# EasyEDA Pro project 1.69_chip_version.eprj

# Schematic Schematic1

## Sheets
1 esp32: Board Name: Board1; Create Date: 2025-05-20; Page Name: esp32; Project Name: 1.69_chip_version; Schematic Name: Schematic1; Update Date: 2025-05-29; Company: EasyEDA.com; Page Size: A4; Version: V1.0
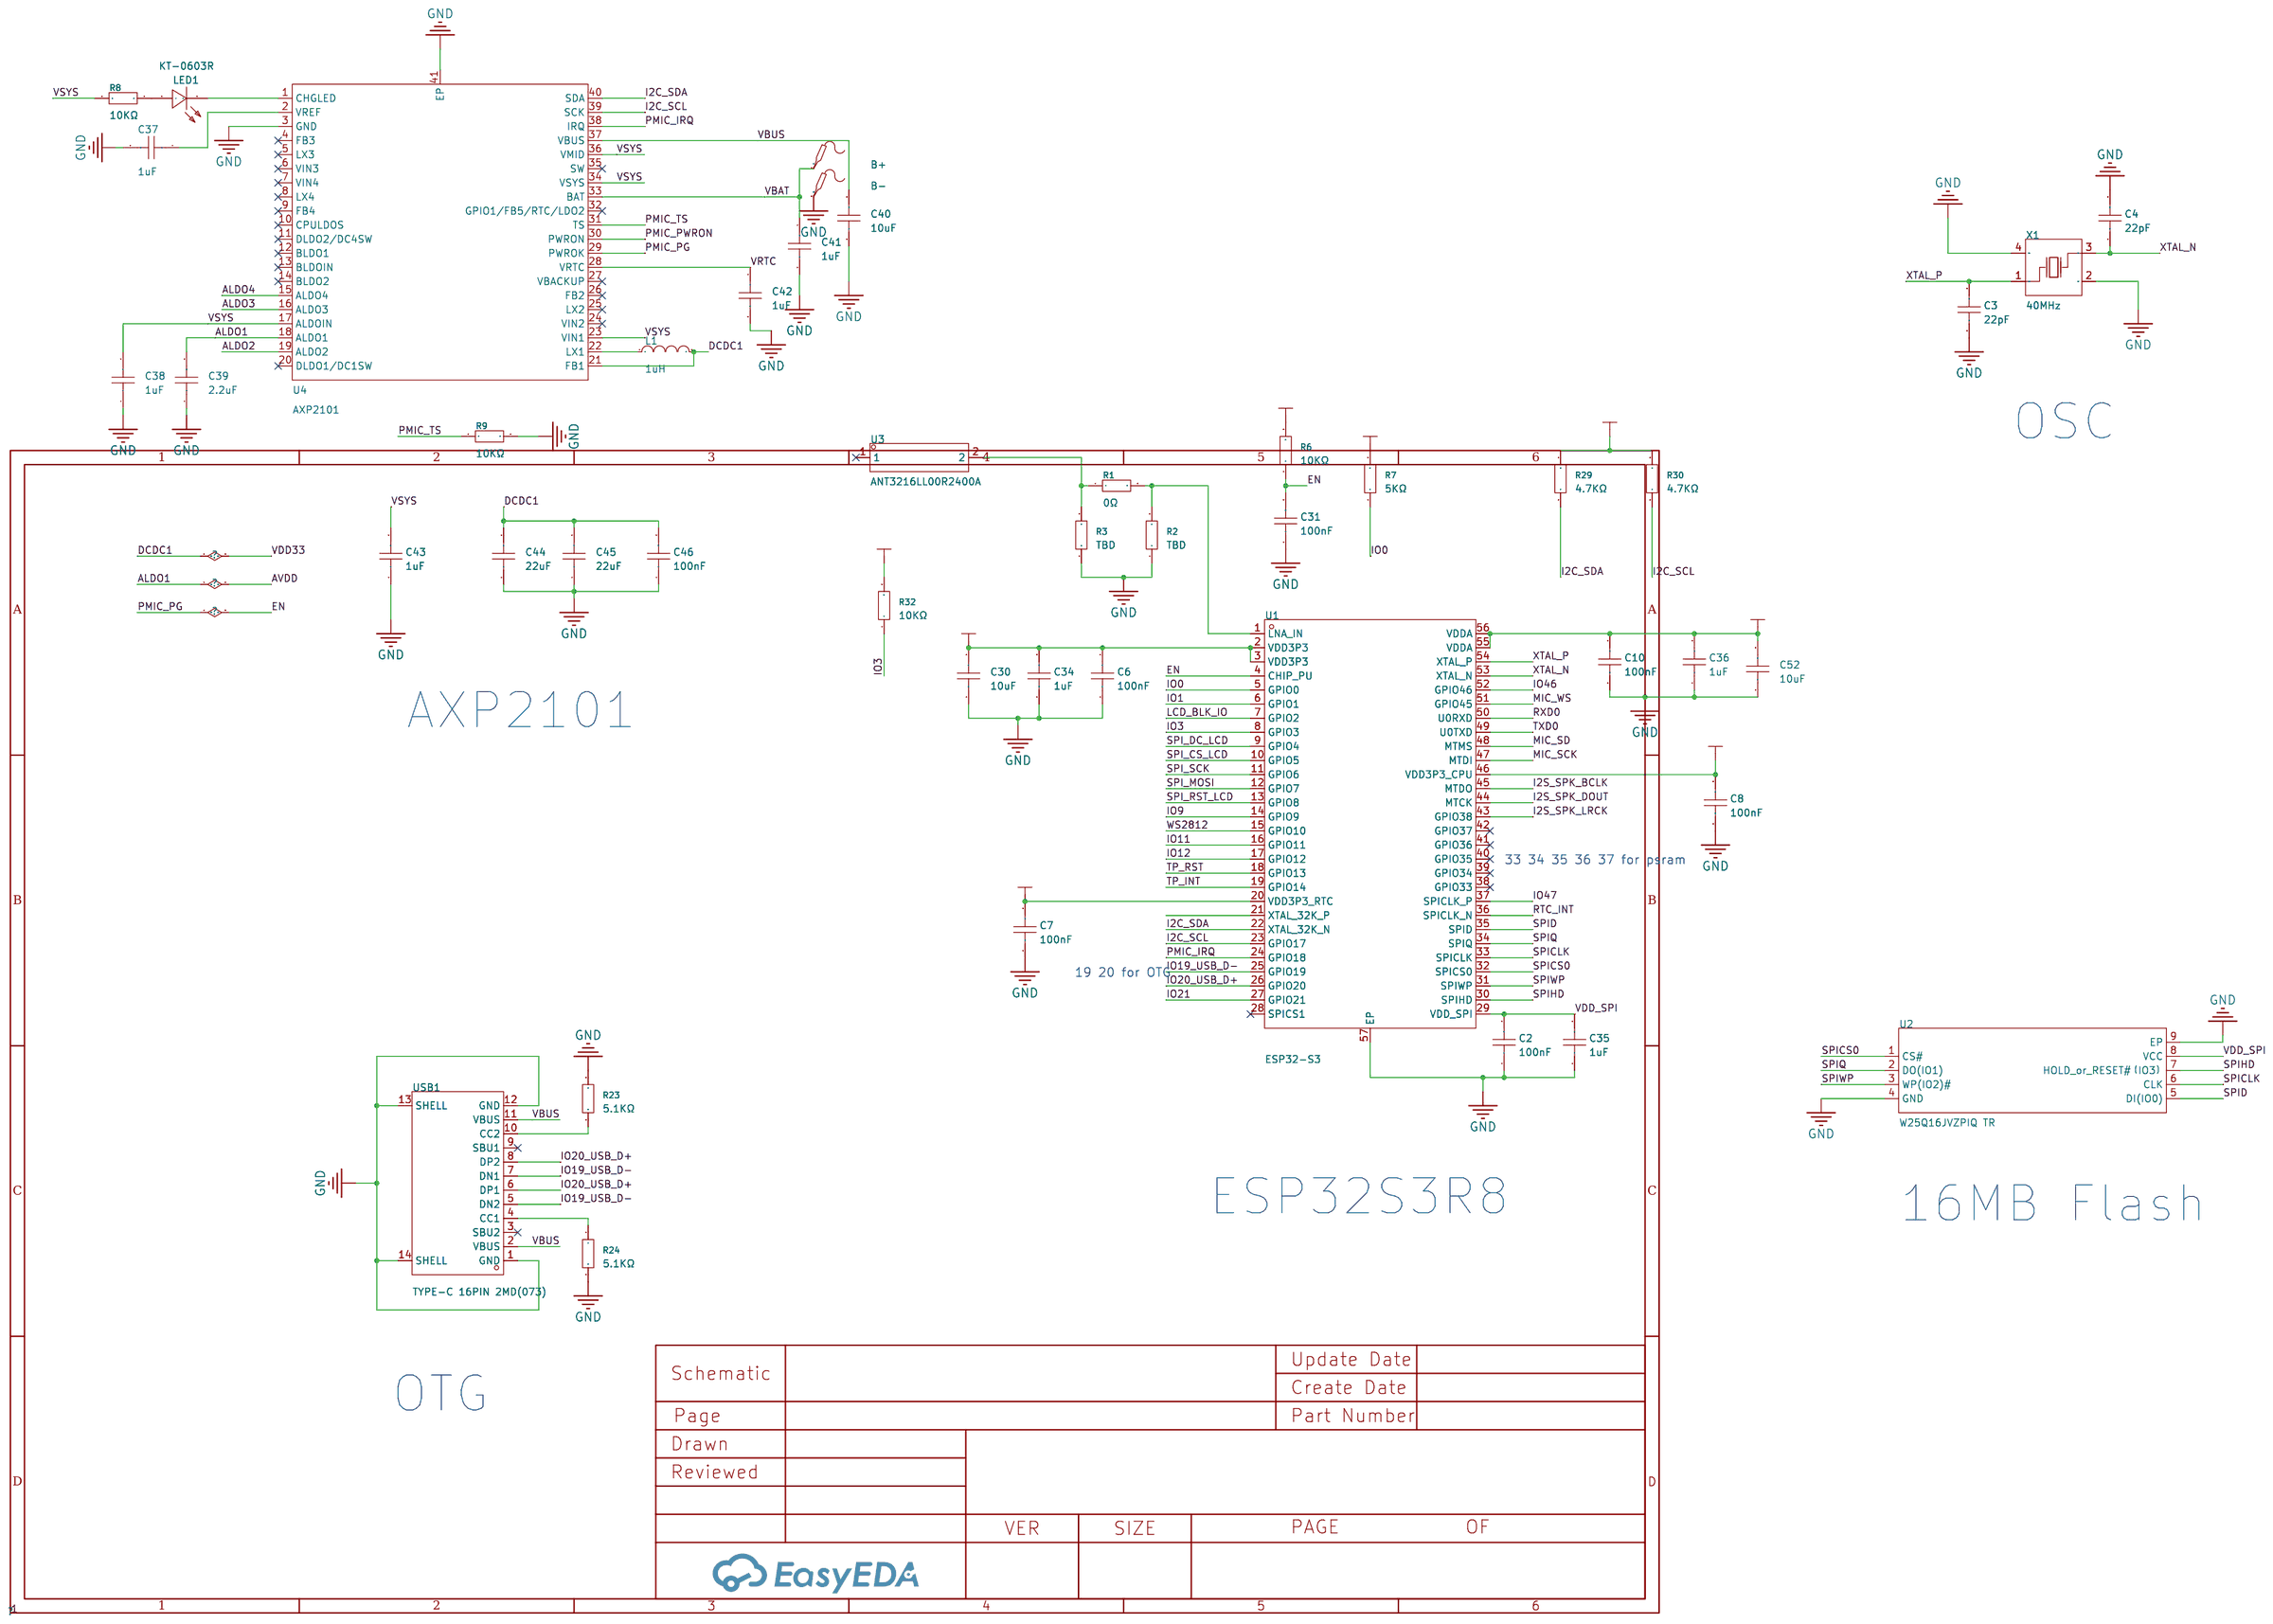
[diagram p0: esp32]
2 peripheral: Page Name: peripheral; Update Date: 2025-05-27
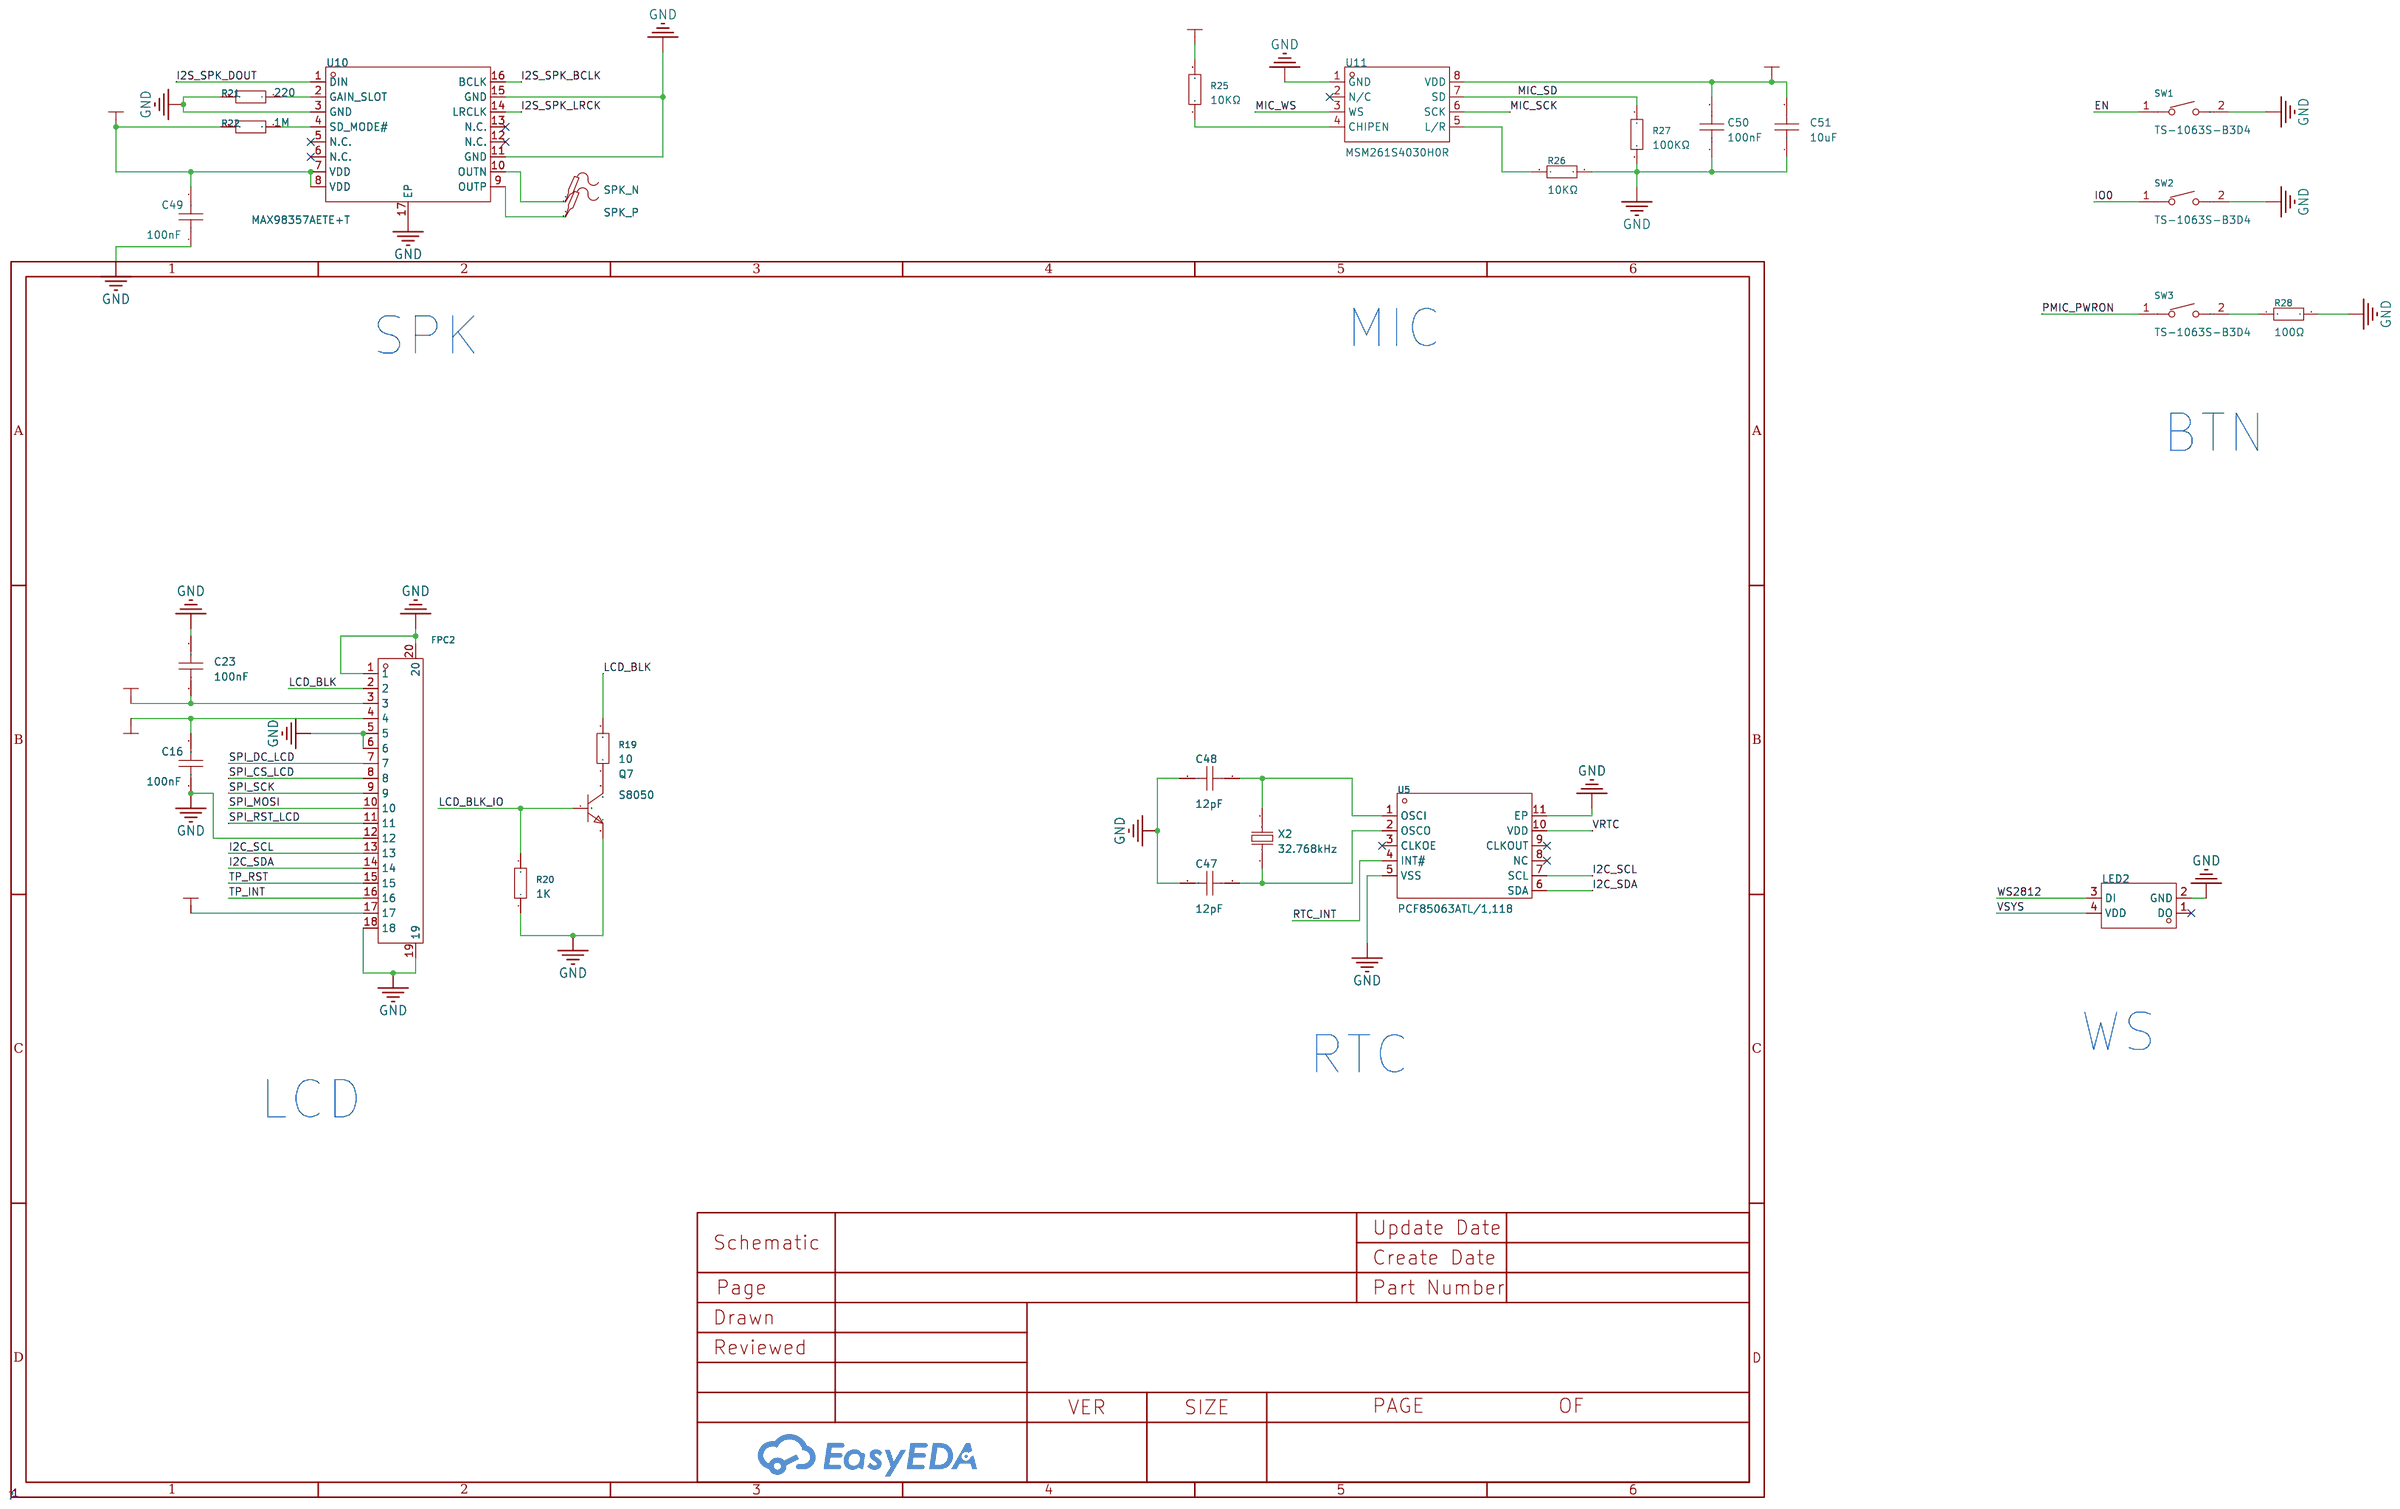
[diagram p1: peripheral]

## Parts
sheet esp32
B+  -  [Test-Point-0.5mm]
B-  -  [Test-Point-0.5mm]
C2  100nF  [C0402]
C3  22pF  [C0402]
C4  22pF  [C0402]
C6  100nF  [C0402]
C7  100nF  [C0402]
C8  100nF  [C0402]
C10  100nF  [C0402]
C30  10uF  [C0603]
C31  100nF  [C0402]
C34  1uF  [C0402]
C35  1uF  [C0402]
C36  1uF  [C0402]
C37  1uF  [C0402]
C38  1uF  [C0402]
C39  2.2uF  [C0603]
C40  10uF  [C0603]
C41  1uF  [C0402]
C42  1uF  [C0402]
C43  1uF  [C0402]
C44  22uF  [C0603]
C45  22uF  [C0603]
C46  100nF  [C0402]
C52  10uF  [C0603]
L1  1uH  [IND-SMD_L4.4-W4.2]
LED1  KT-0603R  [LED0603-RD]
R1  0Ω  [R0402]
R2  TBD  [R0402]
R3  TBD  [R0402]
R6  10KΩ  [R0402]
R7  5KΩ  [R0402]
R8  10KΩ  [R0402]
R9  10KΩ  [R0402]
R23  5.1KΩ  [R0402]
R24  5.1KΩ  [R0402]
R29  4.7KΩ  [R0402]
R30  4.7KΩ  [R0402]
R32  10KΩ  [R0402]
U1  ESP32-S3  [QFN-56_L7.0-W7.0-P0.40-TL-EP4.0]
U2  W25Q16JVZPIQ TR  [WSON-8_L6.0-W5.0-P1.27-BL-EP]
U3  ANT3216LL00R2400A  [ANT-SMD_L3.2-W1.6]
U4  AXP2101  [QFN-40_L5.0-W5.0-P0.40-TL-EP3.4]
USB1  TYPE-C 16PIN 2MD(073)  [USB-C-SMD_TYPE-C-6PIN-2MD-073]
X1  40MHz  [OSC-SMD_4P-L3.2-W2.5-BL_SIT8008BI]
sheet peripheral
C16  100nF  [C0402]
C23  100nF  [C0402]
C47  12pF  [C0402]
C48  12pF  [C0402]
C49  100nF  [C0402]
C50  100nF  [C0402]
C51  10uF  [C0603]
FPC2  FPC-05F-18PH20  [FPC-SMD_18P-P0.50_FPC-05F-18PH20]
LED2  XL-2020RGBC-WS2812B  [LED-SMD_4P-L2.0-W2.0-BR-1]
Q7  S8050  [SOT-23-3_L2.9-W1.3-P1.90-LS2.3-BR]
R19  10  [R0402]
R20  1K  [R0402]
R21  220  [R0402]
R22  1M  [R0402]
R25  10KΩ  [R0402]
R26  10KΩ  [R0402]
R27  100KΩ  [R0402]
R28  100Ω  [R0402]
SPK_N  -  [Test-Point-0.5mm]
SPK_P  -  [Test-Point-0.5mm]
SW1  TS-1063S-B3D4  [KEY-SMD_L3.0-W2.5-LS4.0_TS-1603S]
SW2  TS-1063S-B3D4  [KEY-SMD_L3.0-W2.5-LS4.0_TS-1603S]
SW3  TS-1063S-B3D4  [KEY-SMD_L3.0-W2.5-LS4.0_TS-1603S]
U5  PCF85063ATL/1,118  [DFN-10_L2.6-W2.6-P0.50-BL-EP]
U10  MAX98357AETE+T  [TQFN-16_L3.0-W3.0-P0.50-BL-EP1.5]
U11  MSM261S4030H0R  [MIC-SMD_8P-L4.0-W3.0-P1.00-BR]
X2  32.768kHz  [FC-135R_L3.2-W1.5]

## Library data of the parts
B+ B- SPK_N SPK_P = Test-Point
C2-C4 C6-C8 C10 C31 C34-C38 C41-C43 C46-C48 C50 = CL05A105KA5NQNC: Capacitance: Tolerance:±10% Tolerance:±10% Voltage Rated: Temperature Coefficient:; LCSC Part Name: 1uF ±10% 25V; Supplier Part: C52923; Manufacturer: SAMSUNG(三星); Supplier Footprint: 0402; JLCPCB Part Class: Basic Part; Datasheet: https://atta.szlcsc.com/upload/public/pdf/source/20160218/1457707763339.pdf; Supplier: LCSC; Tolerance: ±10%
C30 C39 C40 C44 C45 C51 C52 = CGA0603X5R106K100JT: Capacitance:10uF Tolerance:±10% Tolerance:±10% Voltage Rating:10V Temperature Coefficient:X5R; LCSC Part Name: 10uF ±10% 10V; Supplier Part: C6119842; Manufacturer: HRE(芯声); Supplier Footprint: 0603; JLCPCB Part Class: Extended Part; Supplier: LCSC; Tolerance: ±10%; Voltage Rating: 10V; Temperature Coefficient: X5R
L1 = FXL0420-1R0-M: LCSC Part Name: 1uH ±20% 7A; Supplier Part: C167203; Manufacturer: cjiang(长江微电); Supplier Footprint: SMD,4.2x4.4mm; JLCPCB Part Class: Extended Part; Datasheet: https://atta.szlcsc.com/upload/public/pdf/source/20240426/3189EA8206330E2108542F9E34E540E7.pdf; Supplier: LCSC; Tolerance: ±20%; Saturation Current (Isat): 7A; Type: Integrated molded inductor
LED1 = KT-0603R: LCSC Part Name: 0603 红灯 高亮; Supplier Part: C2286; Manufacturer: KENTO; Supplier Footprint: 0603; JLCPCB Part Class: Basic Part; Datasheet: https://atta.szlcsc.com/upload/public/pdf/source/20160616/1466072038404.pdf; Supplier: LCSC; Emitted Color: Red; Operating Temperature: -40℃~+85℃
R1-R3 R6-R9 R23-R30 R32 = 0402WGF0000TCE: Type:Thick Film Resistors Resistance: Tolerance:±1% Tolerance:±1% Power(Watts): Overload Voltage (Max): Temperature Coefficient:±800ppm/℃ Temperature Coefficient:±800ppm/℃ Operating Temperature Range:-55℃~+155℃ Operating Temperature Range:-55℃~+155℃; LCSC Part Name: 0Ω ±1% 62.5mW 厚膜电阻; Supplier Part: C17168; Manufacturer: UNI-ROYAL(厚声); Supplier Footprint: 0402; JLCPCB Part Class: Basic Part; Datasheet: https://atta.szlcsc.com/upload/public/pdf/source/20200306/C422600_1E6D84923E4A46A82E41ADD87F860B5C.pdf; Supplier: LCSC; Type: Thick Film Resistors; Tolerance: ±1%; Temperature Coefficient: ±800ppm/℃; Operating Temperature Range: -55℃~+155℃
U1 = ESP32-S3: Frequency Range:2412MHz~2484MHz Frequency Range:2412MHz~2484MHz Interface:ADC,GPIO,I2C,I2S,PWM,SPI,UART,USB Operating Voltage:3V~3.6V Operating Voltage:3V~3.6V Applications:WiFi；IoT Output Power:21dBm Data Rate:150Mbps Current Of Transmitting:340mA Sensit; LCSC Part Name: 支持2.4GHz WIFI和低功耗蓝牙的MCU SoC; Supplier Part: C2913192; Manufacturer: ESPRESSIF(乐鑫); Supplier Footprint: QFN-56-EP(7x7); JLCPCB Part Class: Extended Part; Datasheet: https://atta.szlcsc.com/upload/public/pdf/source/20241030/3428D9BCA56E860957850BFAF37EAC62.pdf; Supplier: LCSC; Frequency Range: 2412MHz~2484MHz; Interface: ADC,GPIO,I2C,I2S,PWM,SPI,UART,USB; Operating Voltage: 3V~3.6V; Applications: WiFi；IoT; Output Power: 21dBm; Data Rate: 150Mbps; Current Of Transmitting: 340mA; Sensitivity: -98.4dBm; Receive Current: 88mA; Typical Application Frequency: 2.4GHz; Operating Temperature: -40℃~+105℃
U2 = W25Q16JVZPIQ TR: Supplier Part: C2456208; Manufacturer: WINBOND(华邦); Supplier Footprint: WSON-8-EP(5x6); JLCPCB Part Class: Extended Part; Datasheet: https://atta.szlcsc.com/upload/public/pdf/source/20190529/C115407_78E5B4F96E7138D299EC51EC5982A1A5.pdf; Supplier: LCSC
U3 = ANT3216LL00R2400A: Antenna Type:Chip Antenna Central Frequency:2450MHz Bandwidth:160MHz Peak Gain:5.05dBi Peak Gain:5.05dBi Polarization Type:Linear Impedance:50Ω Power capacity:1W VSWR:- Operating Temperature:-40℃~+105℃ Operating Temperature:-40℃~+105℃; LCSC Part Name: 无线组件陶瓷芯片天线; Supplier Part: C293767; Manufacturer: YAGEO(国巨); Supplier Footprint: 1206; JLCPCB Part Class: Extended Part; Datasheet: https://atta.szlcsc.com/upload/public/pdf/source/20181012/C293767_CDE82A2F74DC82A94DB708CB53B68F23.pdf; Supplier: LCSC; Antenna Type: Chip Antenna; Central Frequency: 2450MHz; Bandwidth: 160MHz; Peak Gain: 5.05dBi; Polarization Type: Linear; Impedance: 50Ω; Power capacity: 1W; Operating Temperature: -40℃~+105℃
U4 = AXP2101: Supplier Part: C3036461; Manufacturer: x-powers; Supplier Footprint: QFN-40-EP(5x5); JLCPCB Part Class: Extended Part; Datasheet: https://atta.szlcsc.com/upload/public/pdf/source/20230506/27D868F447993329A9E953603DF31964.pdf; Supplier: LCSC
USB1 = TYPE-C 16PIN 2MD(073): LCSC Part Name: Type-C 母 卧贴; Supplier Part: C2765186; Manufacturer: SHOU HAN(首韩); Supplier Footprint: SMD; JLCPCB Part Class: Extended Part; Datasheet: https://atta.szlcsc.com/upload/public/pdf/source/20211123/39B17C16241EAC15C5E277BDA434118E.pdf; Supplier: LCSC; Connector Type: Type-C; Standard: USB 3.1; Gender: Female; Mounting Style: Horizontal attachment; Number of Contacts: 16P; Number of Ports: 1; Current Rating - Power (Max): 5A; Operating Temperature Range: -25℃~+85℃; Rated Voltage (Max): 5V; Connect-Disconnect Life: 5000 Cuts; Core Colour: Black
X1 = X322540MPB4SI: Crystal Type:Surface Mount Crystal Frequency: Normal temperature Frequency Tolerance:±10ppm Normal temperature Frequency Tolerance:±10ppm External load capacitor: Frequency Stability(Full temperature range):±20ppm Frequency Stability(Full temperature rang; LCSC Part Name: 40MHz ±10ppm 15pF; Supplier Part: C9010; Manufacturer: YXC(扬兴晶振); Supplier Footprint: SMD3225-4P; JLCPCB Part Class: Extended Part; Datasheet: https://atta.szlcsc.com/upload/public/pdf/source/20240329/19D5F850207469550BEB00D7DFEDBC7A.pdf; Supplier: LCSC; Crystal Type: Surface Mount Crystal; Normal temperature Frequency Tolerance: ±10ppm; Frequency Stability(Full temperature range): ±20ppm
C16 C23 C49 = CL05B104KO5NNNC: Capacitance: Tolerance:±10% Tolerance:±10% Voltage Rated: Temperature Coefficient:; LCSC Part Name: 100nF ±10% 16V; Supplier Part: C1525; Manufacturer: SAMSUNG(三星); Supplier Footprint: 0402; JLCPCB Part Class: Basic Part; Datasheet: https://atta.szlcsc.com/upload/public/pdf/source/20160218/1457707763339.pdf; Supplier: LCSC; Tolerance: ±10%
FPC2 = FPC-05F-18PH20: Locking Feature:Clamshell Contact Type:Bottom Contact Number of Contacts:18P Pitch:0.5mm Mounting Type:卧贴 FFC, FCB Thickness:0.3mm FFC, FCB Thickness:0.3mm Height Above Board:2mm Operating Temperature Range:-25℃~+85℃ Operating Temperature Range:-25℃~+85℃; LCSC Part Name: 间距:0.5mm P数:18P 翻盖式 下接; Supplier Part: C2856802; Manufacturer: XUNPU(讯普); Supplier Footprint: SMD,P=0.5mm,卧贴; JLCPCB Part Class: Extended Part; Datasheet: https://atta.szlcsc.com/upload/public/pdf/source/20210922/C2856802_2A845D1961F33AEC1ED22CECB292335F.pdf; Supplier: LCSC; Locking Feature: Clamshell; Contact Type: Bottom Contact; Number of Contacts: 18P; Pitch: 0.5mm; Mounting Type: 卧贴; FFC, FCB Thickness: 0.3mm; Height Above Board: 2mm; Operating Temperature Range: -25℃~+85℃
LED2 = XL-2020RGBC-WS2812B: Wavelength:620nm~625nm；470nm~475nm；525nm~530nm Luminous Intensity:150mcd；150mcd；400mcd Lens Color:Translucent Fog Lens Installation method:Positive Stick Operating Temperature:-20℃~+85℃; LCSC Part Name: 幻彩透明; Supplier Part: C5349955; Manufacturer: XINGLIGHT(成兴光); Supplier Footprint: 2020; JLCPCB Part Class: Extended Part; Datasheet: https://atta.szlcsc.com/upload/public/pdf/source/20230111/97A2D5930F183799801175706AF118AF.pdf; Supplier: LCSC; Wavelength: 620nm~625nm；470nm~475nm；525nm~530nm; Luminous Intensity: 150mcd；150mcd；400mcd; Lens Color: Translucent Fog Lens; Installation method: Positive Stick; Operating Temperature: -20℃~+85℃
Q7 = S8050_C20069125: type:NPN Current - Collector(Ic): Collector - Emitter Voltage VCEO: Pd - Power Dissipation:300mW DC Current Gain:120@50mA,1.0V DC Current Gain:120@50mA,1.0V Transition frequency(fT):100MHz Current - Collector Cutoff:100nA Vce Saturation(VCE(sat)):600mV Op; LCSC Part Name: hFE:200-350，丝印:J3Y S8050; Supplier Part: C20069125; Manufacturer: 宏嘉诚; Supplier Footprint: SOT-23; JLCPCB Part Class: Extended Part; Datasheet: https://atta.szlcsc.com/upload/public/pdf/source/20250107/343E8B94B5C24D0D65D7D4B70E0B73F6.pdf; Supplier: LCSC; type: NPN; Pd - Power Dissipation: 300mW; DC Current Gain: 120@50mA,1.0V; Transition frequency(fT): 100MHz; Current - Collector Cutoff: 100nA; Vce Saturation(VCE(sat)): 600mV; Operating Temperature: -55℃~+150℃
R19-R22 = 0402WGF4700TCE: Type:Thick Film Resistors Resistance: Tolerance:±1% Tolerance:±1% Power(Watts): Overload Voltage (Max): Temperature Coefficient:±100ppm/℃ Temperature Coefficient:±100ppm/℃ Operating Temperature Range:-55℃~+155℃ Operating Temperature Range:-55℃~+155℃; LCSC Part Name: 470Ω ±1% 62.5mW 厚膜电阻; Supplier Part: C25117; Manufacturer: UNI-ROYAL(厚声); Supplier Footprint: 0402; JLCPCB Part Class: Basic Part; Datasheet: https://atta.szlcsc.com/upload/public/pdf/source/20200306/C422600_1E6D84923E4A46A82E41ADD87F860B5C.pdf; Supplier: LCSC; Type: Thick Film Resistors; Tolerance: ±1%; Temperature Coefficient: ±100ppm/℃; Operating Temperature Range: -55℃~+155℃
SW1-SW3 = TS-1063S-B3D4: LCSC Part Name: 轻触开关3.0*2.5侧按贴片带柱小小龟250gf; Supplier Part: C498291; Manufacturer: Yuandi(元迪); JLCPCB Part Class: Extended Part; Datasheet: https://atta.szlcsc.com/upload/public/pdf/source/20200318/C498291_A3607BD92317BA61A63F6AFAF35A0DD0.pdf; Supplier: LCSC; Circuit: SPST; Actuator Style: Rectangle button; Operating Force: 250gf
U5 = PCF85063ATL/1,118: Supplier Part: C404360; Manufacturer: NXP(恩智浦); Supplier Footprint: DFN-10-EP(2.6x2.6); JLCPCB Part Class: Extended Part; Datasheet: https://www.nxp.com.cn/docs/en/data-sheet/PCF85063A.pdf; Supplier: LCSC
U10 = MAX98357AETE+T: Type of Power Amplifier: Speaker Channels:Monaural Output Power: Supply Voltage:2.5V~5.5V Supply Voltage:2.5V~5.5V Operating Temperature:-40℃~+85℃ Operating Temperature:-40℃~+85℃; LCSC Part Name: 微型、低成本、PCM 类 D 级放大器具有 AB 级性能; Supplier Part: C910544; Manufacturer: ADI(亚德诺)/MAXIM(美信); Supplier Footprint: TQFN-16-EP(3x3); JLCPCB Part Class: Extended Part; Datasheet: https://atta.szlcsc.com/upload/public/pdf/source/20210106/C910544_CB6DE4B2CEE254A72E6BDB40E718D281.pdf; Supplier: LCSC; Speaker Channels: Monaural; Supply Voltage: 2.5V~5.5V; Operating Temperature: -40℃~+85℃
U11 = MSM261S4030H0R: Supplier Part: C2840615; Manufacturer: MEMS(敏芯微); JLCPCB Part Class: Extended Part; Datasheet: https://atta.szlcsc.com/upload/public/pdf/source/20210707/C2840615_6AE5BCBEE3224C96A8195D5DC270E7C8.pdf; Supplier: LCSC
X2 = Q13FC13500004_C32346: LCSC Part Name: 32.768kHz ±20ppm 12.5pF; Supplier Part: C32346; Manufacturer: EPSON(爱普生); Manufacturer Part: Q13FC13500004; Supplier Footprint: SMD3215-2P; Datasheet: https://atta.szlcsc.com/upload/public/pdf/source/20240418/0E0FF5F0356BA3753F616001439D1416.pdf; Supplier: LCSC; Crystal Type: Surface Mount Crystal; Normal temperature Frequency Tolerance: ±20ppm; Equivalent Series Resistance (ESR): 70kΩ

## Nets
AVDD: C39.2 C49.2 C50.2 C51.2 R22.2 R25.2 U4.18(ALDO1) U10.7(VDD) U10.8(VDD) U11.8(VDD)
GND: B-.1 C2.1 C3.1 C4.2 C6.1 C7.1 C8.1 C10.1 C16.1 C23.1 C30.1 C31.1 C34.1 C35.1 C36.1 C37.2 C38.1 C39.1 C40.1 C41.2 C42.2 C43.1 C44.1 C45.1 C46.1 C47.2 C48.2 C49.1 C50.1 C51.1 C52.1 FPC2.1 FPC2.5 FPC2.6 FPC2.12 FPC2.18 FPC2.19 FPC2.20 LED2.2(GND) Q7.2(E) R2.1 R3.1 R9.1 R20.1 R21.2 R23.1 R24.2 R26.1 R27.2 R28.2 SW1.2 SW2.2 U1.57(EP) U2.4(GND) U2.9(EP) U4.3(GND) U4.41(EP) U5.5(VSS) U5.11(EP) U10.3(GND) U10.11(GND) U10.15(GND) U10.17(EP) U11.1(GND) USB1.1(GND) USB1.12(GND) USB1.13(SHELL) USB1.14(SHELL) X1.2(GND) X1.4(GND)
VBAT: B+.1 C41.1 U4.33(BAT)
VBUS: C40.2 U4.37(VBUS) USB1.2(VBUS) USB1.11(VBUS)
VDD33: C6.2 C7.2 C8.2 C10.2 C16.2 C23.2 C30.2 C34.2 C36.2 C44.2 C45.2 C46.2 C52.2 FPC2.3 FPC2.4 FPC2.17 L1.2 R6.2 R7.2 R29.2 R30.2 R32.2 U1.2(VDD3P3) U1.3(VDD3P3) U1.20(VDD3P3_RTC) U1.46(VDD3P3_CPU) U1.55(VDDA) U1.56(VDDA) U4.21(FB1)
VDD_SPI: C2.2 C35.2 U1.29(VDD_SPI) U2.8(VCC)
ALDO2: U4.19(ALDO2)
ALDO3: U4.16(ALDO3)
ALDO4: U4.15(ALDO4)
EN: C31.2 R6.1 SW1.1 U1.4(CHIP_PU) U4.29(PWROK)
I2C_SCL: FPC2.13 R30.1 U1.23(GPIO17) U4.39(SCK) U5.7(SCL)
I2C_SDA: FPC2.14 R29.1 U1.22(XTAL_32K_N) U4.40(SDA) U5.6(SDA)
I2S_SPK_BCLK: U1.45(MTDO) U10.16(BCLK)
I2S_SPK_DOUT: U1.44(MTCK) U10.1(DIN)
I2S_SPK_LRCK: U1.43(GPIO38) U10.14(LRCLK)
IO0: R7.1 SW2.1 U1.5(GPIO0)
IO1: U1.6(GPIO1)
IO3: R32.1 U1.8(GPIO3)
IO9: U1.14(GPIO9)
IO11: U1.16(GPIO11)
IO12: U1.17(GPIO12)
IO19_USB_D-: U1.25(GPIO19) USB1.5(DN2) USB1.7(DN1)
IO20_USB_D+: U1.26(GPIO20) USB1.6(DP1) USB1.8(DP2)
IO21: U1.27(GPIO21)
IO46: U1.52(GPIO46)
IO47: U1.37(SPICLK_P)
LCD_BLK: FPC2.2 R19.2
LCD_BLK_IO: Q7.1(B) R20.2 U1.7(GPIO2)
MIC_SCK: U1.47(MTDI) U11.6(SCK)
MIC_SD: R27.1 U1.48(MTMS) U11.7(SD)
MIC_WS: U1.51(GPIO45) U11.3(WS)
PMIC_IRQ: U1.24(GPIO18) U4.38(IRQ)
PMIC_PWRON: SW3.1 U4.30(PWRON)
PMIC_TS: R9.2 U4.31(TS)
RTC_INT: U1.36(SPICLK_N) U5.4(INT#)
RXD0: U1.50(U0RXD)
SPI_CS_LCD: FPC2.8 U1.10(GPIO5)
SPI_DC_LCD: FPC2.7 U1.9(GPIO4)
SPI_MOSI: FPC2.10 U1.12(GPIO7)
SPI_RST_LCD: FPC2.11 U1.13(GPIO8)
SPI_SCK: FPC2.9 U1.11(GPIO6)
SPICLK: U1.33(SPICLK) U2.6(CLK)
SPICS0: U1.32(SPICS0) U2.1(CS#)
SPID: U1.35(SPID) U2.5(DI(IO0))
SPIHD: U1.30(SPIHD) U2.7(HOLD or RESET#（IO3）)
SPIQ: U1.34(SPIQ) U2.2(DO(IO1))
SPIWP: U1.31(SPIWP) U2.3(WP(IO2)#)
TP_INT: FPC2.16 U1.19(GPIO14)
TP_RST: FPC2.15 U1.18(GPIO13)
TXD0: U1.49(U0TXD)
VRTC: C42.1 U4.28(VRTC) U5.10(VDD)
VSYS: C38.2 C43.2 LED2.4(VDD) R8.2 U4.17(ALDOIN) U4.23(VIN1) U4.34(VSYS) U4.36(VMID)
WS2812: LED2.3(DI) U1.15(GPIO10)
XTAL_N: C4.1 U1.53(XTAL_N) X1.3(OSC2)
XTAL_P: C3.2 U1.54(XTAL_P) X1.1(OSC1)
$1N906: R1.2 R2.2 U1.1(LNA_IN)
$1N907: R1.1 R3.2 U3.2
$1N2399: C37.1 U4.2(VREF)
$1N3001: L1.1 U4.22(LX1)
$2N460: Q7.3(C) R19.1
$2N979: SPK_P.1 U10.9(OUTP)
$2N980: SPK_N.1 U10.10(OUTN)
$2N984: R22.1 U10.4(SD_MODE#)
$2N986: R21.1 U10.2(GAIN_SLOT)
$2N1004: C47.1 U5.2(OSCO) X2.1
$2N1005: C48.1 U5.1(OSCI) X2.2
$2N2177: R25.1 U11.4(CHIPEN)
$2N2245: R26.2 U11.5(L/R)
Net-(LED1-1): LED1.1(K) U4.1(CHGLED)
Net-(LED1-2): LED1.2(A) R8.1
Net-(R23-2): R23.2 USB1.10(CC2)
Net-(R24-1): R24.1 USB1.4(CC1)
Net-(R28-1): R28.1 SW3.2

Not connected (* = marked no-connect by the designer): LED2 1(DO)*; U1 21(XTAL_32K_P) 28(SPICS1)* 38(GPIO33)* 39(GPIO34)* 40(GPIO35)* 41(GPIO36)* 42(GPIO37)*; U3 1*; U4 4(FB3)* 5(LX3)* 6(VIN3)* 7(VIN4)* 8(LX4)* 9(FB4)* 10(CPULDOS)* 11(DLDO2/DC4SW)* 12(BLDO1)* 13(BLDOIN)* 14(BLDO2)* 20(DLDO1/DC1SW)* 24(VIN2)* 25(LX2)* 26(FB2)* 27(VBACKUP)* 32(GPIO1/FB5/RTC/LDO2)* 35(SW)*; U5 3(CLKOE)* 8(NC)* 9(CLKOUT)*; U10 5(N.C.)* 6(N.C.)* 12(N.C.)* 13(N.C.)*; U11 2(N/C)*; USB1 3(SBU2)* 9(SBU1)*

## Notes on the sheets
sheet 1
- OSC
- AXP2101
- 33 34 35 36 37 for psram
- 19 20 for OTG
- ESP32S3R8
- 16MB Flash
- OTG
sheet 2
- SPK
- MIC
- BTN
- WS
- RTC
- LCD

# Board PCB1
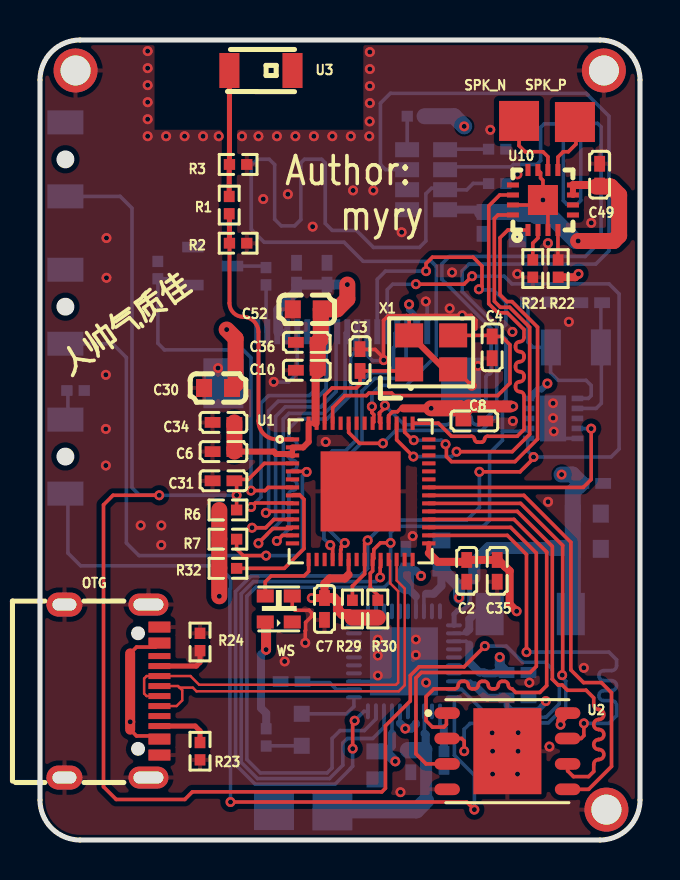
[diagram p2: board, top side]
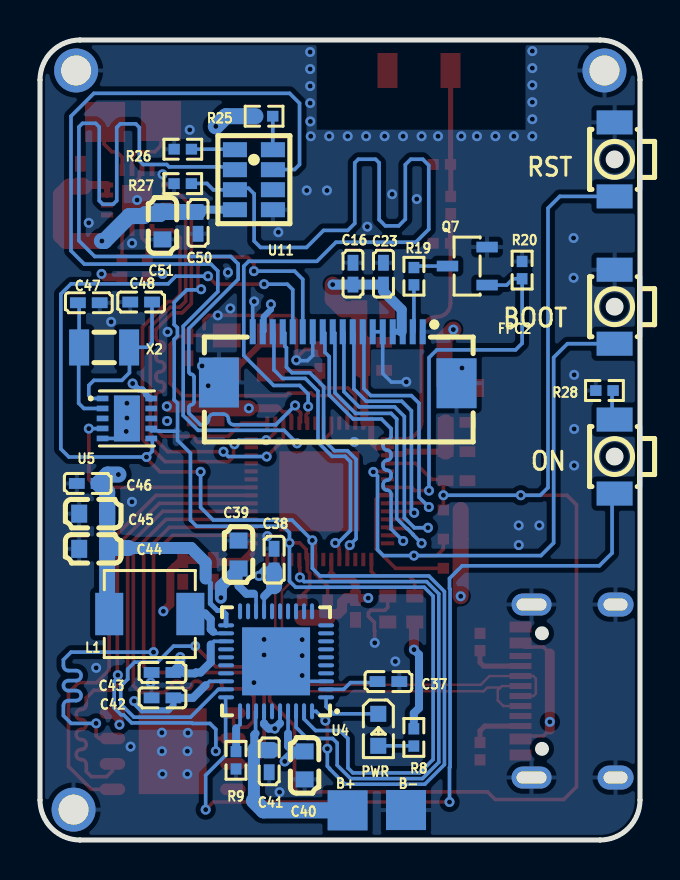
[diagram p3: board, bottom side, seen from below]

Outline 30 x 40 mm; copper layers: Top Layer, GND, PWR, Bottom Layer. Coordinates in mm from the lower left corner of the outline.
Outline path: 0,38 0,2 arc(0.59,0.59) 2,0 28,0 arc(29.41,0.59) 30,2 30,38 arc(29.41,39.41) 28,40 2,40 arc(0.59,39.41) 0,38
Stack: Top Layer 0.035mm Outer layer copper thickness 1oz / Dielectric1 0.2104mm 7628 RC49% 8.6mil / GND 0.0152mm Inner layer copper thickness / Dielectric2 1.065mm 1.1mm H/HOZ Copper / PWR 0.0152mm Inner layer copper thickness / Dielectric3 0.2104mm 7628 RC49% 8.6mil / Bottom Layer 0.035mm Outer layer copper thickness 1oz

## Design rules (mm)
net IO19_USB_D-: DP1
net IO20_USB_D+: DP1
template: Custom Config
spacing copperThickness1oz (default): track to track 0.102, other pairs 0.152 to 0.3
spacing copperThickness2oz: track to track 0.203, other pairs 0.152 to 0.3
track width copperThickness1oz (default): min 0.127, default 0.18, max 2.54
track width copperThickness2oz: min 0.203, default 0.254, max 2.54
differential pair differentialPair (default): width min 0.124, default 0.124, max 0.124; gap min 0.203, default 0.203
via viaSize (default): diameter min 0.5, default 0.5, max 10; hole min 0.25, default 0.25, max 6.3

## Placement (name value [footprint] x y rotation side)
B+  -  [Test-Point-0.5mm]  14.62 1.48 180 bottom
B-  -  [Test-Point-0.5mm]  11.7 1.5 180 bottom
BOOT  TS-1063S-B3D4  [KEY-SMD_L3.0-W2.5-LS4.0_TS-1603S]  1.27 26.66 90 bottom
C2  100nF  [C0402]  21.34 13.46 90 top
C3  22pF  [C0402]  16 24 270 top
C4  22pF  [C0402]  22.61 24.63 270 top
C6  100nF  [C0402]  9.17 19.42 0 top
C7  100nF  [C0402]  14.22 11.55 90 top
C8  100nF  [C0402]  21.72 20.95 180 top
C10  100nF  [C0402]  13.34 23.49 0 top
C16  100nF  [C0402]  14.35 28.32 270 bottom
C23  100nF  [C0402]  12.83 28.32 270 bottom
C30  10uF  [C0603]  8.9 22.6 0 top
C31  100nF  [C0402]  9.17 17.96 0 top
C34  1uF  [C0402]  9.17 20.88 0 top
C35  1uF  [C0402]  22.86 13.46 90 top
C36  1uF  [C0402]  13.34 24.88 0 top
C37  1uF  [C0402]  12.58 7.92 180 bottom
C38  1uF  [C0402]  18.29 14.02 270 bottom
C39  2.2uF  [C0603]  20.07 14.27 270 bottom
C40  10uF  [C0603]  16.77 3.73 90 bottom
C41  1uF  [C0402]  18.54 3.93 270 bottom
C42  1uF  [C0402]  23.88 7.11 0 bottom
C43  1uF  [C0402]  23.88 8.38 180 bottom
C44  22uF  [C0603]  27.34 14.56 180 bottom
C45  22uF  [C0603]  27.34 16.32 180 bottom
C46  100nF  [C0402]  27.61 17.83 180 bottom
C47  12pF  [C0402]  27.56 26.86 180 bottom
C48  12pF  [C0402]  24.94 26.9 0 bottom
C49  100nF  [C0402]  27.98 33.27 270 top
C50  100nF  [C0402]  22.1 30.86 90 bottom
C51  10uF  [C0603]  23.88 30.73 90 bottom
C52  10uF  [C0603]  13.34 26.53 0 top
FPC2  FPC-05F-18PH20  [FPC-SMD_18P-P0.50_FPC-05F-18PH20]  15.11 24.12 180 bottom
L1  1uH  [IND-SMD_L4.4-W4.2]  24.51 11.3 180 bottom
NOREF  -  [Pad_e1424]  1.78 38.48 0 top
NOREF#2  -  [Pad_e1425]  28.19 38.48 0 top
NOREF#3  -  [Pad_e1404]  28.32 1.52 0 top
ON  TS-1063S-B3D4  [KEY-SMD_L3.0-W2.5-LS4.0_TS-1603S]  1.27 19.17 90 bottom
OTG  TYPE-C 16PIN 2MD(073)  [USB-C-SMD_TYPE-C-6PIN-2MD-073]  3.6 7.45 270 top
PWR  KT-0603R  [LED0603-RD]  13.09 5.51 270 bottom
Q7  S8050  [SOT-23-3_L2.9-W1.3-P1.90-LS2.3-BR]  8.64 28.7 180 bottom
R1  0Ω  [R0402]  9.46 31.74 270 top
R2  TBD  [R0402]  9.91 29.84 180 top
R3  TBD  [R0402]  9.91 33.78 180 top
R6  10KΩ  [R0402]  9.4 16.5 180 top
R7  5KΩ  [R0402]  9.4 15.04 180 top
R8  10KΩ  [R0402]  11.31 5.13 90 bottom
R9  10KΩ  [R0402]  20.2 3.98 90 bottom
R19  10  [R0402]  11.3 28.19 270 bottom
R20  1K  [R0402]  5.89 28.49 270 bottom
R21  220  [R0402]  24.64 28.57 270 top
R22  1M  [R0402]  25.91 28.57 270 top
R23  5.1KΩ  [R0402]  8 4.44 90 top
R24  5.1KΩ  [R0402]  8 9.9 90 top
R25  10KΩ  [R0402]  18.8 36.19 0 bottom
R26  10KΩ  [R0402]  22.86 34.54 180 bottom
R27  100KΩ  [R0402]  22.86 32.82 0 bottom
R28  100Ω  [R0402]  1.78 22.47 0 bottom
R29  4.7KΩ  [R0402]  15.62 11.55 270 top
R30  4.7KΩ  [R0402]  16.89 11.55 270 top
R32  10KΩ  [R0402]  9.4 13.58 180 top
RST  TS-1063S-B3D4  [KEY-SMD_L3.0-W2.5-LS4.0_TS-1603S]  1.27 34.03 90 bottom
SPK_N  -  [Test-Point-0.5mm]  23.95 35.95 0 top
SPK_P  -  [Test-Point-0.5mm]  26.75 35.9 0 top
U1  ESP32-S3  [QFN-56_L7.0-W7.0-P0.40-TL-EP4.0]  16.03 17.43 0 top
U2  W25Q16JVZPIQ TR  [WSON-8_L6.0-W5.0-P1.27-BL-EP]  23.37 4.44 270 top
U3  ANT3216LL00R2400A  [ANT-SMD_L3.2-W1.6]  11.05 38.48 180 top
U4  AXP2101  [QFN-40_L5.0-W5.0-P0.40-TL-EP3.4]  18.2 8.93 0 bottom
U5  PCF85063ATL/1,118  [DFN-10_L2.6-W2.6-P0.50-BL-EP]  25.65 21.08 270 bottom
U10  MAX98357AETE+T  [TQFN-16_L3.0-W3.0-P0.50-BL-EP1.5]  25.15 32 0 top
U11  MSM261S4030H0R  [MIC-SMD_8P-L4.0-W3.0-P1.00-BR]  19.3 33.02 180 bottom
WS  XL-2020RGBC-WS2812B  [LED-SMD_4P-L2.0-W2.0-BR-1]  11.94 11.55 0 top
X1  40MHz  [OSC-SMD_4P-L3.2-W2.5-BL_SIT8008BI]  19.56 24.38 0 top
X2  32.768kHz  [FC-135R_L3.2-W1.5]  26.79 24.63 180 bottom

## Footprints (pads in the part's own frame, mm; a bottom-side part is the same pattern mirrored in y, then rotated)
ANT-SMD_L3.2-W1.6
  rect 1x1.75 smd: 1(-1.578,0) 2(1.578,0)
C0402
  rect 0.79x0.54 smd: 1(-0.545,0) 2(0.545,0)
C0603
  rect 0.8x0.9 smd: 1(-0.7,0) 2(0.7,0)
DFN-10_L2.6-W2.6-P0.50-BL-EP
  rect 0.28x0.585 smd: 1(-1,-1.218) 2(-0.5,-1.218) 3(0,-1.218) 4(0.5,-1.218) 5(1,-1.218) 6(1,1.218) 7(0.5,1.218) 8(0,1.218) 9(-0.5,1.218) 10(-1,1.218)
  rect 2.3x1.3 smd: 11(0,0)
FC-135R_L3.2-W1.5
  rect 1x1.8 smd: 1(-1.25,0) 2(1.25,0)
FPC-SMD_18P-P0.50_FPC-05F-18PH20
  rect 0.3x1.25 smd: 1(4.25,1.288) 2(3.75,1.288) 3(3.25,1.288) 4(2.75,1.288) 5(2.25,1.288) 6(1.75,1.288) 7(1.25,1.288) 8(0.75,1.288) 9(0.25,1.288) 10(-0.25,1.288) 11(-0.75,1.288) 12(-1.25,1.288) 13(-1.75,1.288) 14(-2.25,1.288) 15(-2.75,1.288) 16(-3.25,1.288) 17(-3.75,1.288) 18(-4.25,1.288)
  rect 2x2.5 smd: 19(5.94,-1.288) 20(-5.94,-1.252)
IND-SMD_L4.4-W4.2
  rect 1.4x2.12 smd: 1(2.028,0) 2(-2.028,0)
KEY-SMD_L3.0-W2.5-LS4.0_TS-1603S
  rect 1.2x1.8 smd: 1(-1.85,0) 2(1.85,0)
LED0603-RD
  rect 0.8x0.8 smd: 1(-0.799,0) 2(0.799,0)
LED-SMD_4P-L2.0-W2.0-BR-1
  rect 0.85x0.65 smd: 1(0.675,-0.65) 2(0.675,0.65) 3(-0.675,0.65) 4(-0.675,-0.65)
MIC-SMD_8P-L4.0-W3.0-P1.00-BR
  rect 1.2x0.75 smd: 1(0.95,-1.5) 2(0.95,-0.5) 3(0.95,0.5) 4(0.95,1.5) 5(-0.95,1.5) 6(-0.95,0.5) 7(-0.95,-0.5) 8(-0.95,-1.5)
OSC-SMD_4P-L3.2-W2.5-BL_SIT8008BI
  rect 1.4x1.2 smd: 1(-1.1,-0.85) 2(1.1,-0.85) 3(1.1,0.85) 4(-1.1,0.85)
Pad_e1404
  round 2.2 hole 1.5: 1(0,0)
Pad_e1424
  round 2.2 hole 1.5: 1(0,0)
Pad_e1425
  round 2.2 hole 1.5: 1(0,0)
QFN-40_L5.0-W5.0-P0.40-TL-EP3.4
  oval 0.8x0.2 smd: 1(-2.5,1.8) 2(-2.5,1.4) 3(-2.5,1) 4(-2.5,0.6) 5(-2.5,0.2) 6(-2.5,-0.2) 7(-2.5,-0.6) 8(-2.5,-1) 9(-2.5,-1.4) 10(-2.5,-1.8) 21(2.5,-1.8) 22(2.5,-1.4) 23(2.5,-1) 24(2.5,-0.6) 25(2.5,-0.2) 26(2.5,0.2) 27(2.5,0.6) 28(2.5,1) 29(2.5,1.4) 30(2.5,1.8)
  oval 0.2x0.8 smd: 11(-1.8,-2.5) 12(-1.4,-2.5) 13(-1,-2.5) 14(-0.6,-2.5) 15(-0.2,-2.5) 16(0.2,-2.5) 17(0.6,-2.5) 18(1,-2.5) 19(1.4,-2.5) 20(1.8,-2.5) 31(1.8,2.5) 32(1.4,2.5) 33(1,2.5) 34(0.6,2.5) 35(0.2,2.5) 36(-0.2,2.5) 37(-0.6,2.5) 38(-1,2.5) 39(-1.4,2.5) 40(-1.8,2.5)
  rect 3.4x3.4 smd: 41(0,0)
QFN-56_L7.0-W7.0-P0.40-TL-EP4.0
  rect 0.665x0.2 smd: 1(-3.408,2.6) 2(-3.408,2.2) 3(-3.408,1.8) 4(-3.408,1.4) 5(-3.408,1) 6(-3.408,0.6) 7(-3.408,0.2) 8(-3.408,-0.2) 9(-3.408,-0.6) 10(-3.408,-1) 11(-3.408,-1.4) 12(-3.408,-1.8) 13(-3.408,-2.2) 14(-3.408,-2.6) 29(3.408,-2.6) 30(3.408,-2.2) 31(3.408,-1.8) 32(3.408,-1.4) 33(3.408,-1) 34(3.408,-0.6) 35(3.408,-0.2) 36(3.408,0.2) 37(3.408,0.6) 38(3.408,1) 39(3.408,1.4) 40(3.408,1.8) 41(3.408,2.2) 42(3.408,2.6)
  rect 0.2x0.665 smd: 15(-2.6,-3.408) 16(-2.2,-3.408) 17(-1.8,-3.408) 18(-1.4,-3.408) 19(-1,-3.408) 20(-0.6,-3.408) 21(-0.2,-3.408) 22(0.2,-3.408) 23(0.6,-3.408) 24(1,-3.408) 25(1.4,-3.408) 26(1.8,-3.408) 27(2.2,-3.408) 28(2.6,-3.408) 43(2.6,3.408) 44(2.2,3.408) 45(1.8,3.408) 46(1.4,3.408) 47(1,3.408) 48(0.6,3.408) 49(0.2,3.408) 50(-0.2,3.408) 51(-0.6,3.408) 52(-1,3.408) 53(-1.4,3.408) 54(-1.8,3.408) 55(-2.2,3.408) 56(-2.6,3.408)
  rect 4x4 smd: 57(0,0)
R0402
  rect 0.566x0.54 smd: 1(-0.433,0) 2(0.433,0)
SOT-23-3_L2.9-W1.3-P1.90-LS2.3-BR
  rect 1.07x0.532 smd: 1(0.99,-0.95) 2(0.99,0.95) 3(-0.99,0)
Test-Point-0.5mm
  rect 2x2 smd: 1(0,0)
TQFN-16_L3.0-W3.0-P0.50-BL-EP1.5
  rect 0.25x0.6 smd: 1(-0.749,-1.5) 2(-0.248,-1.5) 3(0.252,-1.5) 4(0.751,-1.5) 9(0.75,1.5) 10(0.25,1.5) 11(-0.25,1.5) 12(-0.749,1.5)
  rect 0.6x0.25 smd: 5(1.5,-0.748) 6(1.5,-0.248) 7(1.5,0.252) 8(1.5,0.752) 13(-1.5,0.752) 14(-1.5,0.252) 15(-1.5,-0.248) 16(-1.5,-0.748)
  rect 1.5x1.5 smd: 17(0,0)
USB-C-SMD_TYPE-C-6PIN-2MD-073
  rect 0.55x1.1 smd: 1(-3.2,2.375) 2(-2.4,2.375) 11(2.4,2.375) 12(3.2,2.375)
  rect 0.3x1.1 smd: 3(-1.75,2.375) 4(-1.25,2.375) 5(-0.75,2.375) 6(-0.25,2.375) 7(0.25,2.375) 8(0.75,2.375) 9(1.25,2.375) 10(1.75,2.375)
  oval 1.1x2 hole 0.6x1.5: 13(-4.325,1.825) 14(4.325,1.825)
  oval 1.2x1.8 hole 0.6x1.2: 13(-4.325,-2.375) 14(4.325,-2.375)
WSON-8_L6.0-W5.0-P1.27-BL-EP
  oval 0.581x1.276 smd: 1(-1.905,-3.013) 2(-0.635,-3.013) 3(0.635,-3.013) 4(1.905,-3.013) 5(1.905,3.013) 6(0.635,3.013) 7(-0.635,3.013) 8(-1.905,3.013)
  rect 4.3x3.4 smd: 9(0,0)

## Nets
As in the schematic, except:
GND: B-.1 BOOT.2 C2.1 C3.1 C4.2 C6.1 C7.1 C8.1 C10.1 C16.1 C23.1 C30.1 C31.1 C34.1 C35.1 C36.1 C37.2 C38.1 C39.1 C40.1 C41.2 C42.2 C43.1 C44.1 C45.1 C46.1 C47.2 C48.2 C49.1 C50.1 C51.1 C52.1 FPC2.1 FPC2.5 FPC2.6 FPC2.12 FPC2.18 FPC2.19 FPC2.20 NOREF.1 NOREF#2.1 NOREF#3.1 OTG.1 OTG.12 OTG.13 OTG.14 Q7.2 R2.1 R3.1 R9.1 R20.1 R21.2 R23.1 R24.2 R26.1 R27.2 R28.2 RST.2 U1.57 U2.4 U2.9 U4.3 U4.41 U5.5 U5.11 U10.3 U10.11 U10.15 U10.17 U11.1 WS.2 X1.2 X1.4
VBUS: C40.2 OTG.2 OTG.11 U4.37
EN: C31.2 R6.1 RST.1 U1.4 U4.29
IO0: BOOT.1 R7.1 U1.5
IO19_USB_D-: OTG.5 OTG.7 U1.25
IO20_USB_D+: OTG.6 OTG.8 U1.26
PMIC_PWRON: ON.1 U4.30
VSYS: C38.2 C43.2 R8.2 U4.17 U4.23 U4.34 U4.36 WS.4
WS2812: U1.15 WS.3
$1N2198: PWR.1 U4.1
$1N2237: PWR.2 R8.1
$1N7355: OTG.4 R24.1
$1N7360: OTG.10 R23.2
$2N2724: ON.2 R28.1

Pads without a net: OTG 3 9; U1 28 38 39 40 41 42; U3 1; U4 4 5 6 7 8 9 10 11 12 13 14 20 24 25 26 27 32 35; U5 3 8 9; U10 5 6 12 13; U11 2; WS 1

## Via types
v1: diameter 0.5, hole 0.25, Top Layer to Bottom Layer, 139 vias

## Routing (per net, layer and track width the routed paths; a pad name or vN(x,y) marks a point on that pad's centre or on a via; arc(x,y) is an arc through that point)
AVDD: length 54.3
  Top Layer w0.3: U10.8 U10.7
  Top Layer w0.4: U10.8 27.73,32.75 27.81,32.67 ; v1(26.92,28.3) 26.76,28.14 R22.2
  Top Layer w0.8: 27.81,32.67 28.54,32.67 28.96,32.25 28.96,30.22 28.68,29.95 v1(26.91,29.95)
  PWR w0.8: v1(20.96,12.11) 21.21,12.11 22.35,13.26 22.35,17.66 22.77,18.08 22.77,18.74 22.7,18.81 22.7,25.83 23.94,27.08 26.45,27.08 27.05,27.68 27.05,28.18 v1(26.92,28.3) 26.92,29.93 v1(26.91,29.95) 26.11,30.74 26.11,33.85 25.61,34.36 22.53,34.36 v1(21.21,35.68)
  Bottom Layer w0.18: U4.18 19.2,12.21 19.3,12.31
  Bottom Layer w0.4: C39.2 20.07,12.7 19.69,12.31 19.3,12.31 ; 20.25,31.52 21.98,31.52 C50.2
  Bottom Layer w0.6: v1(20.96,12.11) 20.96,12.69 C39.2
  Bottom Layer w0.8: v1(26.91,29.95) 26.78,29.95 25.53,31.2 24.81,31.2 24.71,31.3 24,31.3 C51.2 23.85,31.4 C50.2 ; R25.2 20.7,36.19 v1(21.21,35.68)
GND: length 32.1
  Top Layer w0.18: v1(13.26,9.86) 13.26,10.46 13.28,10.48 13.28,10.88 13.58,11.18 13.58,11.36 13.45,11.49 12.75,11.49 12.61,11.63 WS.2 ; C3.1 16.02,24.53 16.75,24.53 17.17,24.11 17.17,25.98 17.42,26.22 18.32,26.22 ; U10.15 24.9,31.75 v1(25.15,32) ; X1.4 18.46,26.08 18.32,26.22 ; v1(21.59,22.71) 20.77,23.53 X1.2 ; v1(25.15,32) 25.4,31.75 U10.3 ; v1(25.15,32) 25.15,32.98 25.03,33.1 25.03,33.37 U10.11 ; 18.32,26.22 18.63,26.22 18.64,26.23 v1(21.11,26.23) 21.55,26.23 21.79,25.99 21.79,25.56
  Top Layer w0.3: X1.2 20.23,23.53 18.83,24.93 18.76,24.93 X1.4
  Bottom Layer w0.18: v1(25.69,20.43) 26.04,20.08 U5.5 ; v1(19.29,26.93) 19.36,26.85 FPC2.18 ; v1(17.19,23.99) 17.16,23.97 16.62,23.97 16.36,24.23 FPC2.12 ; v1(11.69,22.91) 11.7,22.9 12.43,22.9 12.86,23.33 FPC2.5 FPC2.6 ; U4.3 16.6,7.93 v1(16.89,8.22)
  vias: v1(3.32,30.1) v1(3.32,28.11) v1(3.29,23.26) v1(3.29,20.55) v1(3.29,18.72) v1(5.03,15.73) v1(5.38,39.44) v1(5.38,38.59) v1(5.38,37.74) v1(5.38,36.89) v1(5.38,36.04) v1(5.38,35.19) v1(6.07,15.73) v1(6.06,14.75) v1(6.31,35.19) v1(7.23,35.19) v1(8.15,35.19) v1(8.9,23.6) v1(8.94,35.19) v1(10.1,35.19) v1(10.92,35.19) v1(11.16,32.05) v1(11.85,35.19) v1(12.23,8.93) v1(12.39,32.29) v1(12.77,35.19) v1(13.63,30.67) v1(13.69,35.19) v1(14.28,19.91) v1(14.62,35.19) v1(15.54,35.19) v1(15.65,32.48) v1(16.49,39.4) v1(16.49,38.55) v1(16.49,37.7) v1(16.49,36.84) v1(16.48,35.93) v1(16.46,35.19) v1(16.67,32.48) v1(16.89,10.02) v1(16.89,9.22) v1(18.02,2.39) v1(18.08,30.39) v1(18.63,15.2) v1(18.8,10.03) v1(18.8,9.25) v1(19.3,7.87) v1(20.48,26.58) v1(20.6,28.38) v1(21.9,23.7) v1(22.52,35.51) v1(22.61,5.36) v1(22.63,4.44) v1(22.63,3.3) v1(23.62,25.41) v1(23.64,20.95) v1(23.87,33.28) v1(23.87,28.3) v1(23.91,5.37) v1(23.9,4.44) v1(23.88,3.3) v1(24.47,7.87) v1(25.4,29.84) v1(25.4,16.91) v1(25.47,4.67) v1(25.65,21.84) v1(25.65,21.1) v1(26.44,25.91) v1(27.19,8.61) v1(27.56,30.86)
VBAT: length 10.2
  Bottom Layer w0.18: 19.22,5.33 19.22,6.41 U4.33
  Bottom Layer w0.4: 19.22,5.33 19.28,5.27 19.28,4.59 ; 19.22,4.52 19.3,4.44
  Bottom Layer w0.6: 19.3,4.44 19.3,1.96
  Bottom Layer w0.8: 19.22,4.52 19.2,4.5 18.4,4.5 ; B+.1 18.82,1.48 19.3,1.96
VBUS: length 24.9
  Top Layer w0.18: 4.51,9.33 4.83,9.65 5.77,9.65 OTG.2 ; 4.51,5.52 4.83,5.2 5.82,5.2 5.97,5.05
  Top Layer w0.5: 4.51,9.33 v1(4.51,5.91) 4.51,5.52
  PWR w1: v1(4.51,5.91) 6.03,5.91 8.38,3.55 17.38,3.55 v1(17.76,3.93)
  Bottom Layer w0.18: U4.37 17.6,5.33
  Bottom Layer w0.4: 17.31,4.41 17.6,4.69 17.6,5.33
  Bottom Layer w0.5: v1(17.76,3.93) 17.28,4.41 17.17,4.41 17.15,4.43 C40.2
VDD33: length 107.6
  Top Layer w0.18: 21.17,20.95 21.17,21.42 ; 17.43,20.84 17.43,21.22 17.63,21.41 17.87,21.41 18.04,21.58 18.16,21.58
  Top Layer w0.2: 15.43,13.27 15.43,14.02
  Top Layer w0.25: 13.43,20.84 U1.55 ; 12.62,19.23 12.62,19.63
  Top Layer w0.3: 12.62,19.63 13.16,19.63 13.43,19.9 13.43,20.84 ; C6.2 11.69,19.42 11.81,19.3 12.56,19.3 12.62,19.23
  Top Layer w0.4: v1(19.56,21.58) 18.16,21.58 ; v1(13.59,12.1) C7.2 14.22,12.82 14.48,13.08 15.24,13.08 15.43,13.27 ; 13.78,20.84 13.78,23.38 C10.2
  Top Layer w0.5: C7.2 14.7,12.1 14.9,11.9 14.9,11.51 15.11,11.3 15.44,11.3 15.62,11.12
  Top Layer w0.6: 21.43,21.68 23.53,21.68
  Top Layer w0.7: 21.17,21.42 21.43,21.68
  Top Layer w0.8: C30.2 9.78,22.78 9.78,25.08 v1(9.33,25.52) ; v1(8.97,12.19) R32.2 R7.2 R6.2 ; v1(15.37,27.77) 15.37,27.05 14.86,26.53 C52.2 14.04,25.04 C36.2 C10.2 ; v1(19.56,21.58) 21.01,21.58 21.17,21.42 ; 15.62,11.12 16.89,11.12 ; C34.2 C6.2
  PWR w0.5: v1(26.08,18.27) 26.08,19.17 25.47,19.78 25.38,19.78 25,20.16 25,21 24.32,21.68
  PWR w0.6: v1(23.66,21.68) 24.32,21.68
  PWR w0.8: v1(15.37,27.77) 16.04,27.77 17.03,26.78 v1(18.46,26.78) ; v1(15.37,27.77) 15.37,23.08 15.84,22.6 18.54,22.6 v1(19.56,21.58) ; v1(15.37,27.77) 15.33,27.81 10.41,27.81 10.01,27.4 10.01,25.88 9.65,25.52 v1(9.33,25.52) 7.87,25.52 7.37,25.01 7.37,12.69 7.87,12.19 v1(8.97,12.19) 13.5,12.19 v1(13.59,12.1)
  Bottom Layer w0.25: U4.21 20.7,10.74 20.7,11.3 20.88,11.47 21.13,11.47 21.48,11.83 21.48,12.84 21.72,13.08
  Bottom Layer w0.3: 11.92,25.41 FPC2.4 ; FPC2.17 18.81,25.46 18.81,26.16 18.46,26.52 v1(18.46,26.78)
  Bottom Layer w0.5: v1(15.37,27.77) C16.2 C23.2 12.83,27.43 11.92,26.52 11.92,25.41 ; 26.64,11.4 L1.2
  Bottom Layer w0.6: 25.6,14.58 25.58,14.6 22.45,14.6 21.72,13.87 21.72,13.08
  Bottom Layer w0.8: v1(26.08,18.27) 26.62,18.27 C46.2 26.64,17.4 C45.2 26.64,14.6 ; 26.64,11.4 26.64,14.6 ; C44.2 26.64,14.6 ; 26.64,14.6 25.58,14.6
VDD_SPI: length 15.4
  Top Layer w0.25: U1.29 19.44,14.35
  Top Layer w0.4: v1(26.03,5.77) 26.03,5.99 U2.8 ; 19.44,14.35 19.88,13.91 21.24,13.91 C2.2 C35.2 22.92,14 23.26,13.66 23.28,13.66 23.48,13.45 23.48,11.79 v1(23.83,11.44)
  PWR w0.4: v1(23.83,11.44) 23.9,11.51 23.9,9.82 23.72,9.64 23.72,9.14 23.9,8.96 23.9,8.16 23.87,8.12 23.87,7.62 23.9,7.58 23.9,6.76 24.32,6.34 25.33,6.34 25.9,5.77 v1(26.03,5.77)
EN: length 81.8
  Top Layer w0.18: v1(22.24,9.69) 21.21,8.66 18.95,8.66 18.51,8.22 18.51,6.95 17.27,5.71 17.27,2.59 17.09,2.41 7.62,2.41 7.24,2.03 3.81,2.03 3.18,2.66 3.18,16.76 3.65,17.24 v1(5.96,17.24) ; U1.4 11.22,18.83 10.41,18.03 9.79,18.03 C31.2 9.83,17.85 v1(9.83,17.24) R6.1
  Bottom Layer w0.18: v1(22.24,9.69) 23.32,9.69 24.13,8.89 25.27,8.89 25.62,8.54 25.62,8.04 25.96,7.69 25.96,6.8 25.3,6.14 22.47,6.14 21.08,7.53 U4.29 ; 1.14,32.18 4.01,32.18 4.6,31.59 4.6,17.62 4.98,17.24 v1(5.96,17.24) v1(9.83,17.24)
I2C_SCL: length 60.5
  Top Layer w0.18: v1(17.53,14.85) 17.02,14.85 16.69,14.53 16.69,14.08 16.63,14.02 16.63,13.45 16.51,13.33 16.51,12.62 16.89,12.24 R30.1 ; v1(21.94,27.54) 22.1,27.69 22.1,28.7 21.65,29.14 19.62,29.14 19.3,28.82 v1(19.3,28.44)
  Bottom Layer w0.18: v1(21.94,27.54) 21.97,27.51 22.67,27.51 23.29,26.88 23.29,25.77 23.13,25.61 23.13,25.2 23.29,25.04 23.29,22.01 23.12,21.84 23.12,20.44 ; 23.12,20.44 23.12,19.99 22.48,19.34 22.48,16 22.17,15.69 17.85,15.69 17.53,15.36 v1(17.53,14.85) 17.53,12.95 17.22,12.64 10.79,12.64 10.34,12.19 10.34,4.03 11.02,3.35 14.35,3.35 14.61,3.6 14.61,5.08 15,5.47 16.22,5.47 16.8,6.05 U4.39 ; 23.12,20.44 24.02,20.44 24.04,20.46 24.42,20.46 24.44,20.48 U5.7 ; FPC2.13 16.86,28.03 17.27,28.44 v1(19.3,28.44)
I2C_SDA: length 69
  Top Layer w0.18: v1(16.38,14.98) 16.23,14.83 16.23,13.31 15.62,12.69 R29.1 ; v1(18.8,27.79) 21.2,27.79 v1(21.6,28.19) ; v1(21.97,18.41) 24,18.41 24.68,19.08 v1(24.68,19.15) ; v1(15.73,5.96) 15.63,5.86 v1(15.63,4.57)
  Bottom Layer w0.18: v1(21.6,28.19) 23.21,28.19 23.59,27.81 28.45,27.81 28.96,27.3 28.96,19.55 28.55,19.15 v1(24.68,19.15) 24.38,19.44 24.38,20.02 U5.6 ; v1(15.63,4.57) 15.63,3.69 15.52,3.58 15.52,3.56 14.75,2.79 10.76,2.79 9.78,3.77 9.78,12.43 10.56,13.2 16,13.2 16.38,13.58 v1(16.38,14.98) 17.4,16 21.34,16 21.97,16.63 v1(21.97,18.41) ; FPC2.14 17.36,27.52 17.64,27.79 v1(18.8,27.79) ; U4.40 16.2,6.43 v1(15.73,5.96)
I2S_SPK_BCLK: length 21.1
  Top Layer w0.18: U1.45 17.83,20.01 v1(18.67,19.17) ; U10.16 22.9,31.25 22.72,31.07 22.72,26.93 23.02,26.64 23.49,26.64 24.48,25.64 24.48,20.29 23.61,19.42 v1(20.83,19.42)
  Bottom Layer w0.18: v1(18.67,19.17) 20.58,19.17 v1(20.83,19.42)
I2S_SPK_DOUT: length 21.1
  Top Layer w0.18: 18.23,20.84 18.23,20.39 18.66,19.96 v1(18.69,19.99) ; v1(20.28,19.79) 20.32,19.75 20.32,19.17 20.57,18.92 23.75,18.92 24.88,20.05 24.88,25.64 23.6,26.92 23.35,26.92 23,27.27 23,30.11 23.39,30.5 U10.1
  Bottom Layer w0.18: v1(18.69,19.99) 20.08,19.99 v1(20.28,19.79)
I2S_SPK_LRCK: length 21.4
  Top Layer w0.18: 18.63,20.84 19.92,20.84 20.57,20.19 21.58,20.19 arc(21.68,20.14) 21.73,20.04 arc(21.77,19.93) 21.88,19.89 22.08,19.89 arc(22.18,19.93) 22.23,20.04 arc(22.27,20.14) 22.38,20.19 23.86,20.19 24.2,20.53 24.2,22.2 arc(24.14,22.35) 23.99,22.42 arc(23.84,22.48) 23.78,22.63 23.78,22.7 arc(23.84,22.85) 23.99,22.92 arc(24.14,22.98) 24.2,23.13 24.2,23.2 arc(24.14,23.35) 23.99,23.42 arc(23.84,23.48) 23.78,23.63 23.78,23.7 arc(23.84,23.85) 23.99,23.92 arc(24.14,23.98) 24.2,24.13 24.2,24.2 arc(24.14,24.35) 23.99,24.42 arc(23.84,24.48) 23.78,24.63 23.78,24.7 arc(23.84,24.85) 23.99,24.92 arc(24.14,24.98) 24.2,25.13 24.2,25.52 23.37,26.35 22.9,26.35 22.44,26.82 22.44,31.7 22.99,32.25 U10.14
IO0: length 28.6
  Top Layer w0.18: v1(11.3,14.22) 10.16,14.22 9.83,14.55 R7.1 ; U1.5 13.31,18.43 v1(13.33,18.4)
  Bottom Layer w0.18: BOOT.1 3.63,24.81 4.32,24.12 4.32,14.85 4.95,14.22 v1(11.3,14.22) 12.83,14.22 13.12,14.52 13.12,18.19 v1(13.33,18.4)
IO3: length 6.9
  Top Layer w0.18: U1.8 12.66,17.27 12.96,17.27 13.2,17.03 13.2,14.57 12.22,13.58 R32.1
IO19_USB_D-: length 20.9
  Top Layer w0.124: OTG.7 5.33,7.2 5.21,7.32 5.21,8.07 5.33,8.2 OTG.5 7.52,8.2 7.96,7.76 17.8,7.76 17.91,7.87 17.91,12.44 17.51,12.84 17.51,13.95 U1.25
IO20_USB_D+: length 20.9
  Top Layer w0.124: 6.98,7.62 7.11,7.49 7.11,6.98 6.83,6.7 OTG.8 ; 6.98,7.62 6.9,7.7 OTG.6 ; 6.98,7.62 7.64,7.62 7.83,7.43 17.93,7.43 18.23,7.73 18.23,12.58 17.83,12.98 U1.26
LCD_BLK: length 2.4
  Bottom Layer w0.18: R19.2 11.31,27.75 11.31,25.4
LCD_BLK_IO: length 18.9
  Top Layer w0.18: v1(10.55,17.47) 11.25,17.47 11.41,17.63 U1.7
  Bottom Layer w0.18: 7.65,27.75 6.67,27.75 6.35,28.06 R20.2 5.89,24.83 6.22,24.51 10.16,24.51 10.55,24.12 v1(10.55,17.47)
MIC_SCK: length 48
  Top Layer w0.18: 17.03,20.84 16.97,20.9 16.97,21.27 16.97,21.27 16.97,21.36 17.14,21.52 17.14,21.7 17.17,21.73 v1(17.25,21.73)
  Bottom Layer w0.18: v1(17.25,21.73) 18.21,20.76 20.31,20.76 arc(20.5,20.84) 20.58,21.03 arc(20.65,21.22) 20.84,21.3 21.31,21.3 arc(21.5,21.22) 21.58,21.03 arc(21.65,20.84) 21.84,20.76 21.98,20.76 22.56,21.34 22.56,21.63 arc(22.52,21.72) 22.43,21.76 arc(22.34,21.8) 22.3,21.89 22.3,21.9 22.3,23.15 22.3,23.16 arc(22.34,23.25) 22.43,23.28 arc(22.52,23.32) 22.56,23.41 22.56,25.57 20.09,28.03 20.09,28.81 20.46,29.18 27.26,29.18 28.06,29.97 28.06,35.65 27.88,35.83 27.22,35.83 27.04,35.65 27.04,31.97 26.86,31.79 26.34,31.79 26.16,31.97 26.16,35.63 25.98,35.81 25.21,35.81 25.03,35.63 25.03,33.97 24.84,33.78 23.67,33.78 23.55,33.66 20.4,33.66 20.25,33.52
MIC_SD: length 47.6
  Top Layer w0.18: v1(16.59,21.67) 16.59,21.37 16.69,21.27 16.69,20.9 16.63,20.84
  Bottom Layer w0.18: 22.43,32.89 22.37,32.83 21.66,32.83 21.34,32.51 20.26,32.51 20.18,32.59 19.57,32.59 19.29,32.31 19.29,29.95 18.97,29.63 16.67,29.63 15.82,30.48 14.61,30.48 14.26,30.83 14.26,33.86 14.08,34.04 13.22,34.04 13.04,33.86 13.04,31.02 12.73,30.71 12.06,30.71 11.73,31.04 11.73,33.77 11.46,34.04 10.86,34.04 10.56,33.74 10.56,30.53 11.21,29.89 15.2,29.89 16.16,28.94 19.57,28.94 19.81,28.69 19.81,24.22 18.32,22.73 17.02,22.73 16.59,22.3 v1(16.59,21.67)
MIC_WS: length 47.7
  Top Layer w0.18: 15.43,20.84 15.43,20.38 15.98,19.83 v1(17.15,19.83)
  Bottom Layer w0.18: U11.3 18.35,33.52 17.27,33.52 17.02,33.77 17.02,36.84 17.52,37.33 27.31,37.33 28.45,36.19 28.45,29.46 27.78,28.8 21.45,28.8 21.11,28.45 21.11,27.42 22.84,25.69 22.84,21.23 22.1,20.48 17.79,20.48 v1(17.15,19.83)
PMIC_IRQ: length 26.6
  Top Layer w0.18: v1(17.01,13.13) 17.01,13.62 17.03,13.65 17.03,14.02
  Bottom Layer w0.18: U4.38 17.2,5.63 16.64,5.08 15.37,5.08 15.14,4.85 15.14,3.74 14.47,3.07 10.88,3.07 10.06,3.89 10.06,12.31 10.67,12.92 16.8,12.92 v1(17.01,13.13)
PMIC_PWRON: length 41.2
  Top Layer w0.18: v1(21.72,1.52) 21.34,1.9 v1(9.53,1.9)
  Bottom Layer w0.18: v1(9.53,1.9) 9.53,3.62 9.5,3.65 9.5,12.54 9.53,12.57 9.53,13.08 8.89,13.71 2.03,13.71 1.4,14.35 1.4,17.32 ; U4.30 20.72,7.11 20.72,4.24 21.72,3.24 v1(21.72,1.52)
PMIC_TS: length 2.1
  Bottom Layer w0.18: U4.31 20,5.78 20.19,5.58
  Bottom Layer w0.4: 20.19,5.58 20.19,4.42 R9.2
RTC_INT: length 11.5
  Top Layer w0.18: v1(27.56,20.57) 27.56,18.03 27.16,17.63 U1.36
  Bottom Layer w0.18: v1(27.56,20.57) 26.88,20.57 U5.4
SPI_CS_LCD: length 12.7
  Top Layer w0.18: v1(11.29,16.36) 11.36,16.43 U1.10
  Bottom Layer w0.18: v1(11.29,16.36) 11.43,16.5 11.43,21.46 11.91,21.94 13.69,21.94 14.31,22.55 14.31,25.4
SPI_DC_LCD: length 13.4
  Top Layer w0.18: v1(10.56,16.65) 10.76,16.85 12.61,16.85 U1.9
  Bottom Layer w0.18: 13.81,25.4 13.81,22.56 13.46,22.22 11.43,22.22 11.05,21.84 11.05,17.14 v1(10.56,16.65)
SPI_MOSI: length 15.5
  Top Layer w0.18: U1.12 12.57,15.57 11.64,15.57 10.92,14.85 v1(10.92,14.83)
  Bottom Layer w0.18: 15.31,25.4 15.26,25.35 15.26,22.36 14.22,21.33 12.45,21.33 12.16,21.05 12.16,16.08 11.66,15.57 11.64,15.57 11.35,15.28 11.35,15.26 v1(10.92,14.83)
SPI_RST_LCD: length 15.2
  Top Layer w0.18: v1(11.84,14.95) 12.12,15.23 U1.13
  Bottom Layer w0.18: 15.81,25.4 15.76,25.35 15.76,24.39 15.54,24.17 15.54,22.24 14.34,21.05 12.93,21.05 12.45,20.57 12.45,20.19 arc(12.5,20.05) 12.64,19.99 arc(12.78,19.93) 12.84,19.79 12.84,19.69 arc(12.78,19.55) 12.64,19.49 arc(12.5,19.43) 12.45,19.29 12.45,19.19 arc(12.5,19.05) 12.64,18.99 arc(12.78,18.93) 12.84,18.79 12.84,18.69 arc(12.78,18.55) 12.64,18.49 arc(12.5,18.43) 12.45,18.29 12.45,18.19 arc(12.5,18.05) 12.64,17.99 arc(12.78,17.93) 12.84,17.79 12.84,17.69 arc(12.78,17.55) 12.64,17.49 arc(12.5,17.43) 12.45,17.29 12.45,15.55 v1(11.84,14.95)
SPI_SCK: length 15.2
  Top Layer w0.18: U1.11 12.62,16.03 11.7,16.03 11.28,15.61 v1(10.6,15.61)
  Bottom Layer w0.18: v1(10.6,15.61) 11.28,15.61 11.78,16.11 11.78,21.18 12.26,21.66 14.04,21.66 14.81,22.42 14.81,25.4
SPICLK: length 23.3
  Top Layer w0.18: U2.6 26.38,3.46 26.67,3.17 27.43,3.17 27.69,3.42 27.69,3.77 arc(27.76,3.95) 27.94,4.02 27.94,4.02 arc(28.19,4.27) 27.94,4.52 27.94,4.52 arc(27.69,4.77) 27.94,5.02 27.94,5.02 arc(28.19,5.27) 27.94,5.52 27.94,5.52 arc(27.69,5.77) 27.94,6.02 27.94,6.02 arc(28.19,6.27) 27.94,6.52 27.94,6.52 arc(27.76,6.6) 27.69,6.77 27.69,7.11 27.31,7.49 26.37,7.49 26.11,7.75 25.9,7.75 25.62,8.04 25.62,14.68 23.87,16.43 U1.33
SPICS0: length 23.9
  Top Layer w0.18: U1.32 23.7,16.03 25.33,14.4 25.33,7.72 24.99,7.38 23.78,7.38 23.6,7.56 arc(23.47,7.61) 23.42,7.75 arc(23.36,7.88) 23.23,7.93 23.1,7.93 arc(22.97,7.88) 22.92,7.75 arc(22.86,7.61) 22.73,7.56 22.6,7.56 arc(22.47,7.61) 22.42,7.75 arc(22.36,7.88) 22.23,7.93 22.1,7.93 arc(21.97,7.88) 21.92,7.75 arc(21.86,7.61) 21.73,7.56 21.6,7.56 arc(21.47,7.61) 21.42,7.75 arc(21.36,7.88) 21.23,7.93 21.1,7.93 arc(20.97,7.88) 20.92,7.75 arc(20.86,7.61) 20.73,7.56 19.69,7.56 19.3,7.17 19.3,5.96 19.62,5.65 20.19,5.65 20.32,5.77 20.32,6.31 U2.1
SPID: length 23.3
  Top Layer w0.18: U2.5 27.43,2.53 28.58,3.68 28.58,7.36 28.07,7.87 27.18,7.87 26.54,8.5 26.54,14.88 24.2,17.23 U1.35
SPIHD: length 23.6
  Top Layer w0.18: U2.7 27.05,5.08 27.19,5.22 v1(27.19,5.83) ; U1.30 23.37,15.23 24.32,14.28 v1(24.32,9.39)
  Bottom Layer w0.18: v1(24.32,9.39) 28.45,9.39 28.83,9.01 28.83,8.72 arc(28.76,8.54) 28.58,8.47 28.19,8.47 arc(27.94,8.22) 28.19,7.97 28.58,7.97 arc(28.83,7.72) 28.58,7.47 28.19,7.47 arc(27.94,7.22) 28.19,6.97 28.58,6.97 arc(28.76,6.9) 28.83,6.72 28.83,6.22 28.44,5.83 v1(27.19,5.83)
SPIQ: length 23.8
  Top Layer w0.18: v1(26.11,8.24) 26.11,8.36 26.13,8.39 26.13,14.73 24.03,16.83 U1.34 ; v1(21.21,4.44) 21.21,4.95 21.08,5.08 U2.2
  Bottom Layer w0.18: 21.21,4.44 21.21,5.53 21.5,5.83 22.38,5.83 22.41,5.86 25.42,5.86 25.82,6.26 25.94,6.26 26.29,6.6 26.29,7.94 26.11,8.12 v1(26.11,8.24)
SPIWP: length 23.4
  Top Layer w0.18: U1.31 23.53,15.63 24.82,14.35 24.82,8.68 24.51,8.38 19.07,8.38 18.8,8.1 18.8,4.31 19.3,3.8 U2.3
TP_INT: length 14.5
  Top Layer w0.18: v1(15.24,14.85) 15.06,14.67 15.06,14.54 15.03,14.51 15.03,14.02
  Bottom Layer w0.18: 18.31,25.4 18.31,23.51 17.88,23.08 16.74,23.08 16.1,22.45 16.1,19.89 15.4,19.18 14.74,19.18 14.48,18.92 14.48,15.47 15.1,14.85 v1(15.24,14.85)
TP_RST: length 14
  Top Layer w0.18: v1(14.51,14.74) 14.63,14.62 14.63,14.02
  Bottom Layer w0.18: v1(14.51,14.74) 14.2,15.06 14.2,19.03 14.63,19.46 15.28,19.46 15.82,20 15.82,22.67 16.51,23.36 17.4,23.36 17.68,23.64 17.68,24.61 17.76,24.69 17.76,25.35 17.81,25.4
VRTC: length 28.2
  PWR w0.5: v1(25.37,22.82) 25.47,22.73 28.19,22.73 28.58,22.35 28.58,19.93 27.94,19.3 27.94,7.74 27.15,6.95 v1(25.29,6.95)
  Bottom Layer w0.18: U4.28 21.53,7.93 21.72,7.74
  Bottom Layer w0.3: C42.1 23.33,6.73 23.58,6.48 24.89,6.48 25.29,6.89 v1(25.29,6.95) ; U5.10 24.5,22.08 24.7,22.28 24.7,22.35 24.88,22.53 25.07,22.53 v1(25.37,22.82)
  Bottom Layer w0.4: 21.72,7.74 22.35,7.11 C42.1
VSYS: length 40
  Top Layer w0.5: v1(11.3,9.52) 11.3,10.86 WS.4
  PWR w0.8: v1(18.26,5.57) 19.93,5.57 20.45,6.09 20.45,7.36 21.01,7.93 21.77,7.93 v1(22.99,9.14) 22.82,9.14 22.57,8.89 21.91,8.89 21.44,9.36 21.44,10.03 21.91,10.5 21.5,10.91 20.62,10.91 19.82,11.71 19.82,12.43 v1(19.05,13.2) 18.26,13.2 15.97,10.92 11.89,10.92 11.25,10.28 11.25,9.57 v1(11.3,9.52)
  Bottom Layer w0.18: U4.17 18.8,12.19 ; 21.46,9.77 21.3,9.93 U4.23 ; U4.36 18,5.84 ; 18.8,5.84 U4.34
  Bottom Layer w0.4: 18.8,12.19 18.29,12.69 ; C38.2 18.78,13.47 v1(19.05,13.2) ; 11.31,5.56 11.31,6.34 11.05,6.6 11.05,9.27 v1(11.3,9.52) ; 18,5.84 v1(18.26,5.57) 18.57,5.57 18.8,5.8 18.8,5.84 ; C43.2 22.79,8.38 22.75,8.33 22.25,8.33 22.2,8.38 21.97,8.38 21.46,8.88 21.46,9.77
  Bottom Layer w0.5: C43.2 22.99,8.72 v1(22.99,9.14)
  Bottom Layer w0.8: 18.29,12.69 C38.2
WS2812: length 3.7
  Top Layer w0.18: 13.43,14.02 13.43,13.43 13.21,13.2 11.56,13.2 11.26,12.91 WS.3
XTAL_N: length 15.2
  Top Layer w0.18: X1.3 22.56,25.23 C4.1 23.08,25.18 23.5,24.77 23.5,22.83 22.88,22.22 17.71,22.22 17.58,22.35 16.45,22.35 16.32,22.22 15.24,22.22 14.63,21.61 14.63,20.84
XTAL_P: length 6.5
  Top Layer w0.18: X1.1 18.38,23.45 C3.2 16,22.78 15.82,22.6 14.61,22.6 14.23,22.23 14.23,20.84
$1N906: length 13.4
  Top Layer w0.2: R2.2 9.47,26.84 arc(9.67,26.36) 10.16,26.16 arc(10.7,25.93) 10.92,25.39 10.92,20.95 arc(11.19,20.3) 11.84,20.03 U1.1
  Top Layer w0.254: R2.2 9.47,31.3 arc(9.47,31.31) R1.2
$1N907: length 6.4
  Top Layer w0.254: R1.1 9.46,33.76 arc(9.46,33.77) R3.2 9.47,38.35 arc(9.44,38.44) 9.34,38.48
$1N2198: length 3.2
  Bottom Layer w0.18: U4.1 15.7,6.67 15.33,6.31 PWR.1
$1N2237: length 1.8
  Bottom Layer w0.18: PWR.2 11.32,4.71 R8.1
$1N2399: length 2.7
  Bottom Layer w0.18: C37.1 13.18,7.87 14.48,7.87 14.81,7.53 U4.2
$1N3001: length 2.4
  Bottom Layer w0.18: U4.22 21.26,10.33
  Bottom Layer w0.4: L1.1 22.45,11.33 21.75,11.33 21.46,11.04 21.46,10.54 21.34,10.41
$1N7355: length 2.4
  Top Layer w0.254: OTG.4 7.81,8.7 8,8.88 8,9.21
$1N7360: length 2.7
  Top Layer w0.254: OTG.10 7.76,5.7 8,5.46 8,4.87
$2N460: length 1.7
  Bottom Layer w0.18: Q7.3 11.23,28.7 R19.1
$2N979: length 2.9
  Top Layer w0.18: SPK_P.1 26.8,35.85 26.8,34.79 26.42,34.41 26.16,34.41 25.9,34.15 U10.9
$2N980: length 3.6
  Top Layer w0.18: SPK_N.1 23.95,34.72 24.26,34.41 25.15,34.41 25.4,34.16 U10.10
$2N984: length 1.6
  Top Layer w0.18: 26.03,29 25.9,29.14 U10.4
$2N986: length 1.6
  Top Layer w0.18: R21.1 24.64,29.84 24.9,30.1 U10.2
$2N1004: length 6.4
  Bottom Layer w0.18: U5.2 27.81,21.58 28.07,21.84 28.07,24.6 X2.1 28.04,26.8 C47.1
$2N1005: length 8.1
  Bottom Layer w0.18: U5.1 27.42,22.08 27.56,22.22 27.56,22.73 27.31,22.98 25.91,22.98 25.53,23.36 25.53,24.61 X2.2 25.53,24.64 24.64,24.64 24.4,24.88 C48.1
$2N2177: length 1.7
  Bottom Layer w0.18: U11.4 18.36,34.52 R25.1
$2N2245: length 2.2
  Bottom Layer w0.18: 20.25,34.52 20.28,34.54 R26.2
$2N2724: length 1.5
  Bottom Layer w0.18: 1.4,21.02 1.4,22.42 R28.1

## Copper pours and planes (outline as drawn; the poured copper is in the pictures)
GND on Top Layer: -1.7,41.25 31.68,41.25 31.68,-2.38 -1.7,-2.38
GND on Bottom Layer: -1.93,41.2 31.45,41.2 31.45,-2.43 -1.93,-2.43
GND on GND: -1.72,41.87 31.66,41.87 31.66,-1.76 -1.72,-1.76
GND on PWR: -1.9,42.11 31.48,42.11 31.48,-1.52 -1.9,-1.52

Small or netless copper shapes (teardrops, artwork), in the pictures only: 1 on Bottom Layer

## Text on the board
Top Silkscreen Layer: Author: / myry | 人帅气质佳
